# EasyEDA Pro project PX4_FMUv6X_Dev_Board.eprj, schematic FMUv6X Dev Board, sheets 1 to 6 of 11

## Sheets
1 Power MUX: Board Name: Board1; Create Date: 2025-08-13; Page Name: Power MUX; Project Name: PX4_FMUv6X_Dev_Board; Schematic Name: FMUv6X Dev Board; Update Date: 2025-08-14; Company: EasyEDA.com; Page Size: A4; Version: V1.0
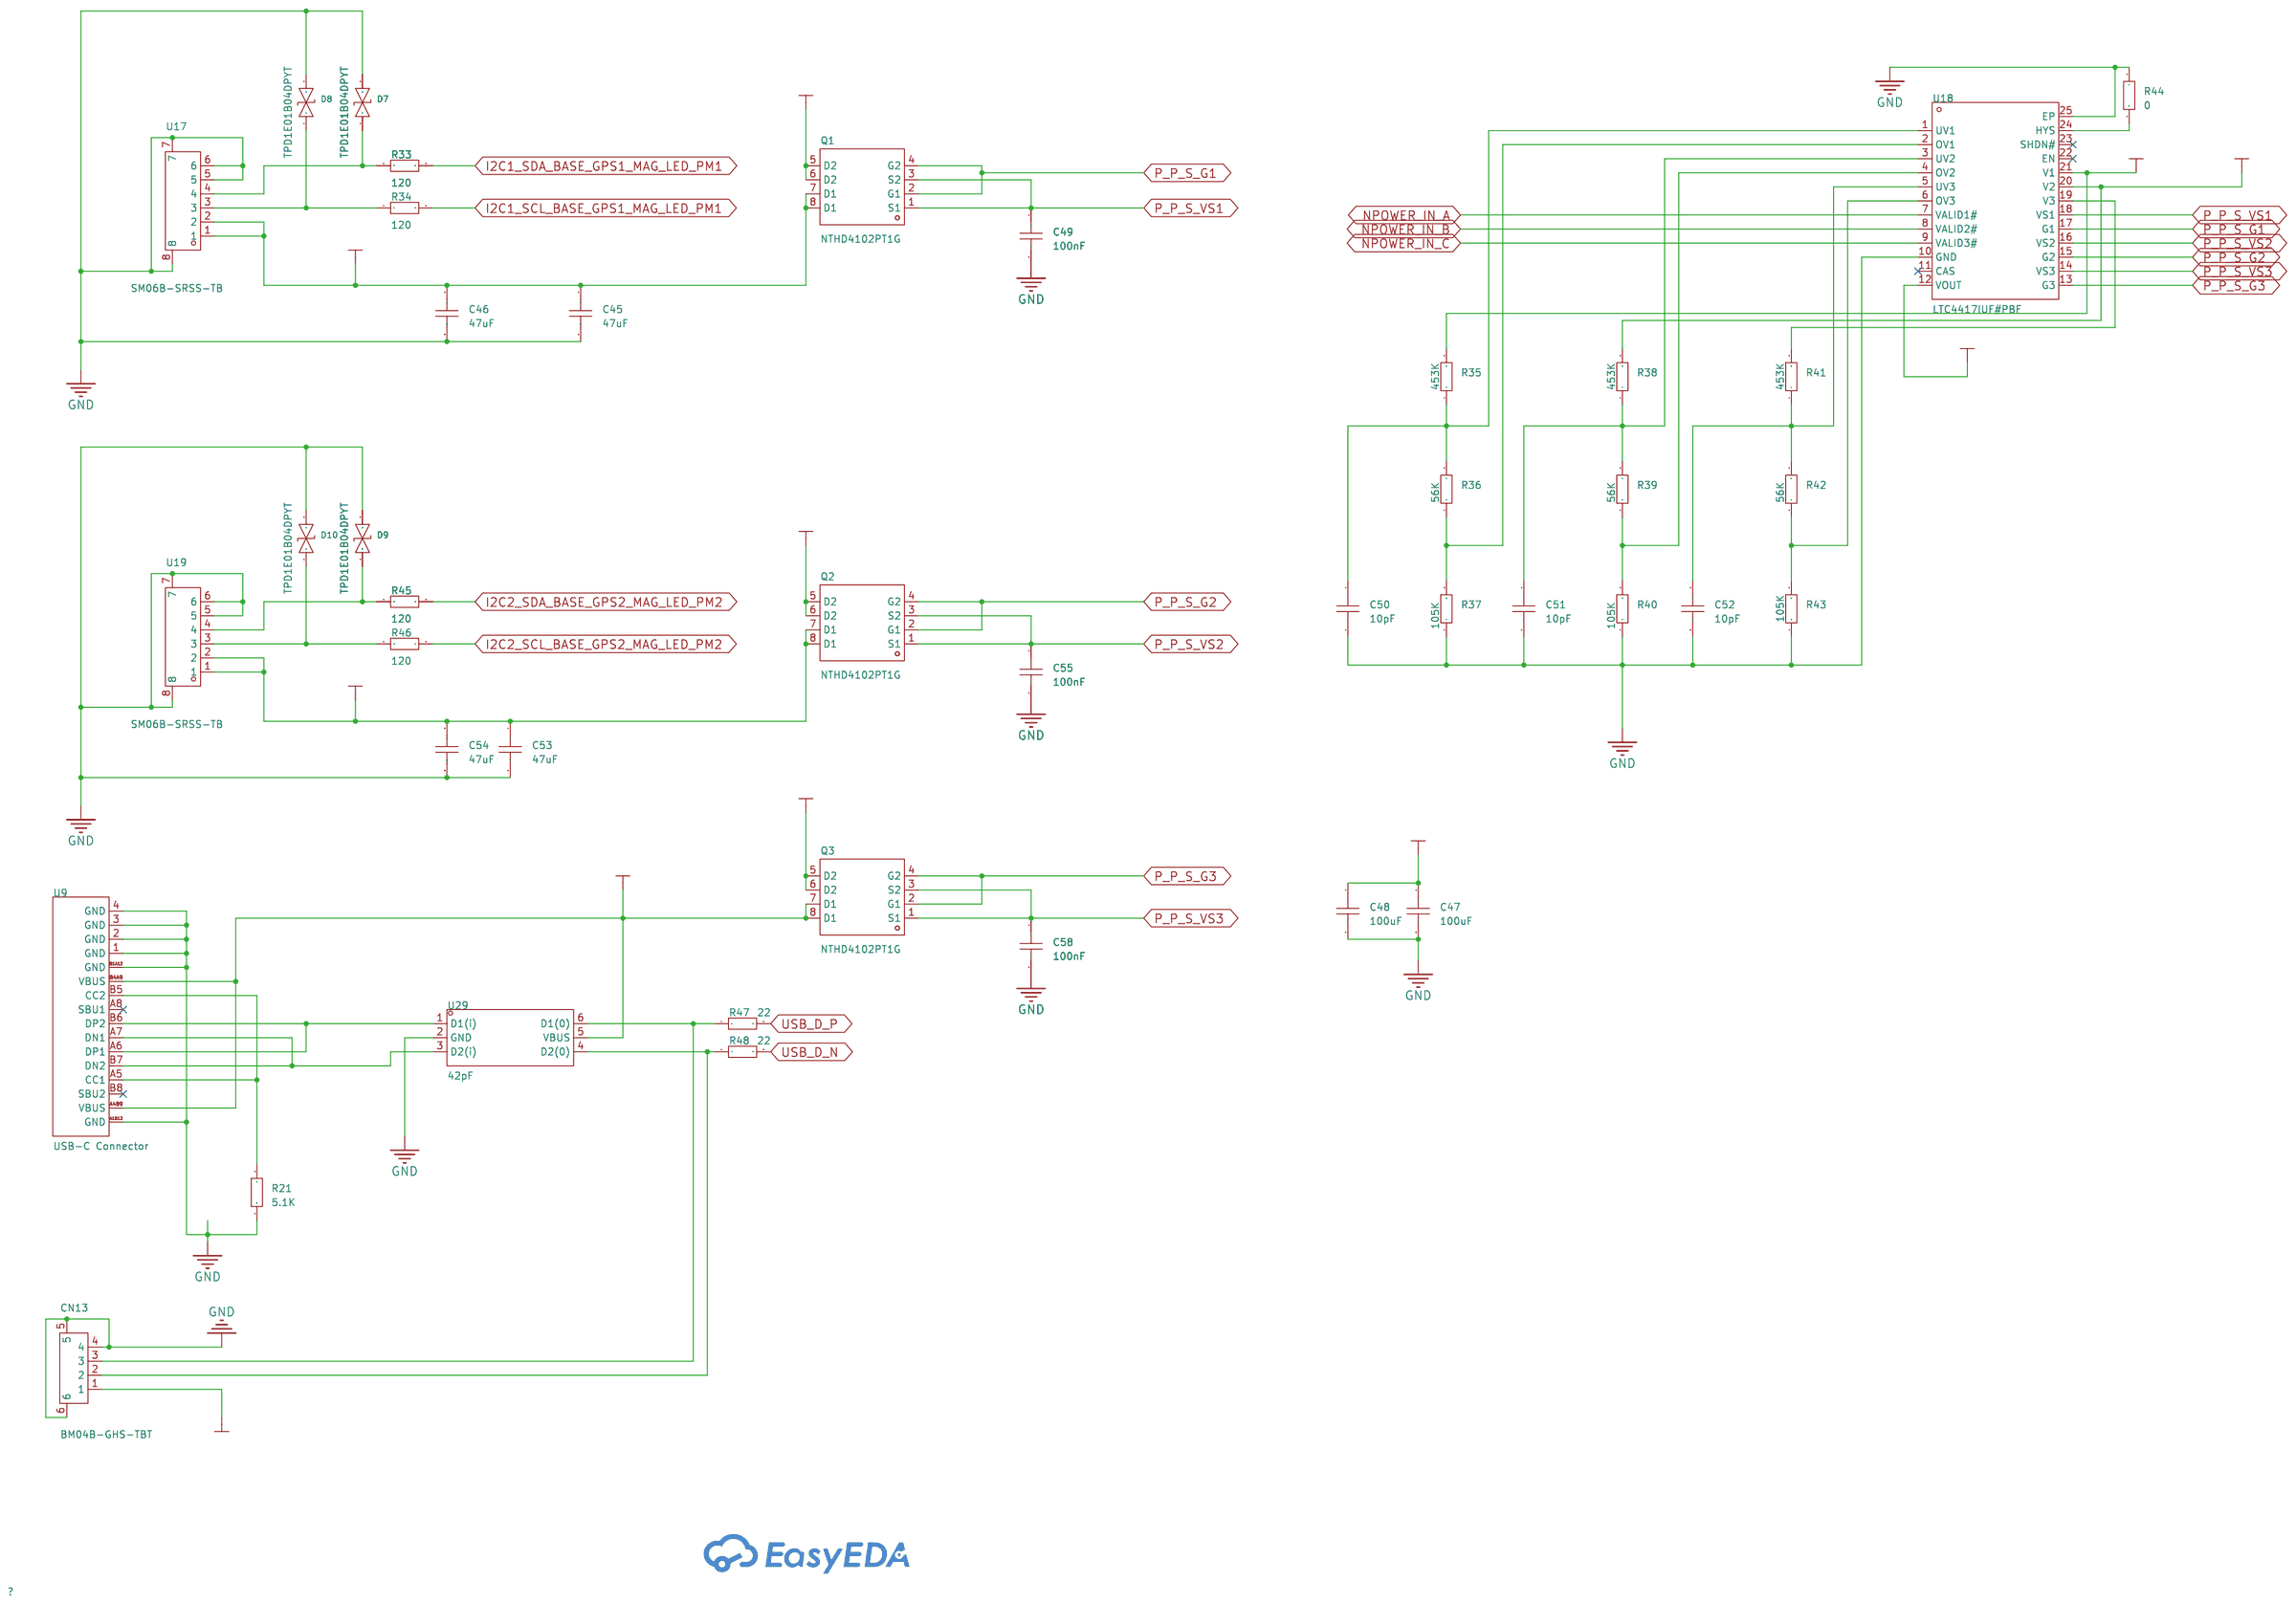
[diagram p0: Power MUX]
2 Power: Page Name: Power; Update Date: 2025-08-17
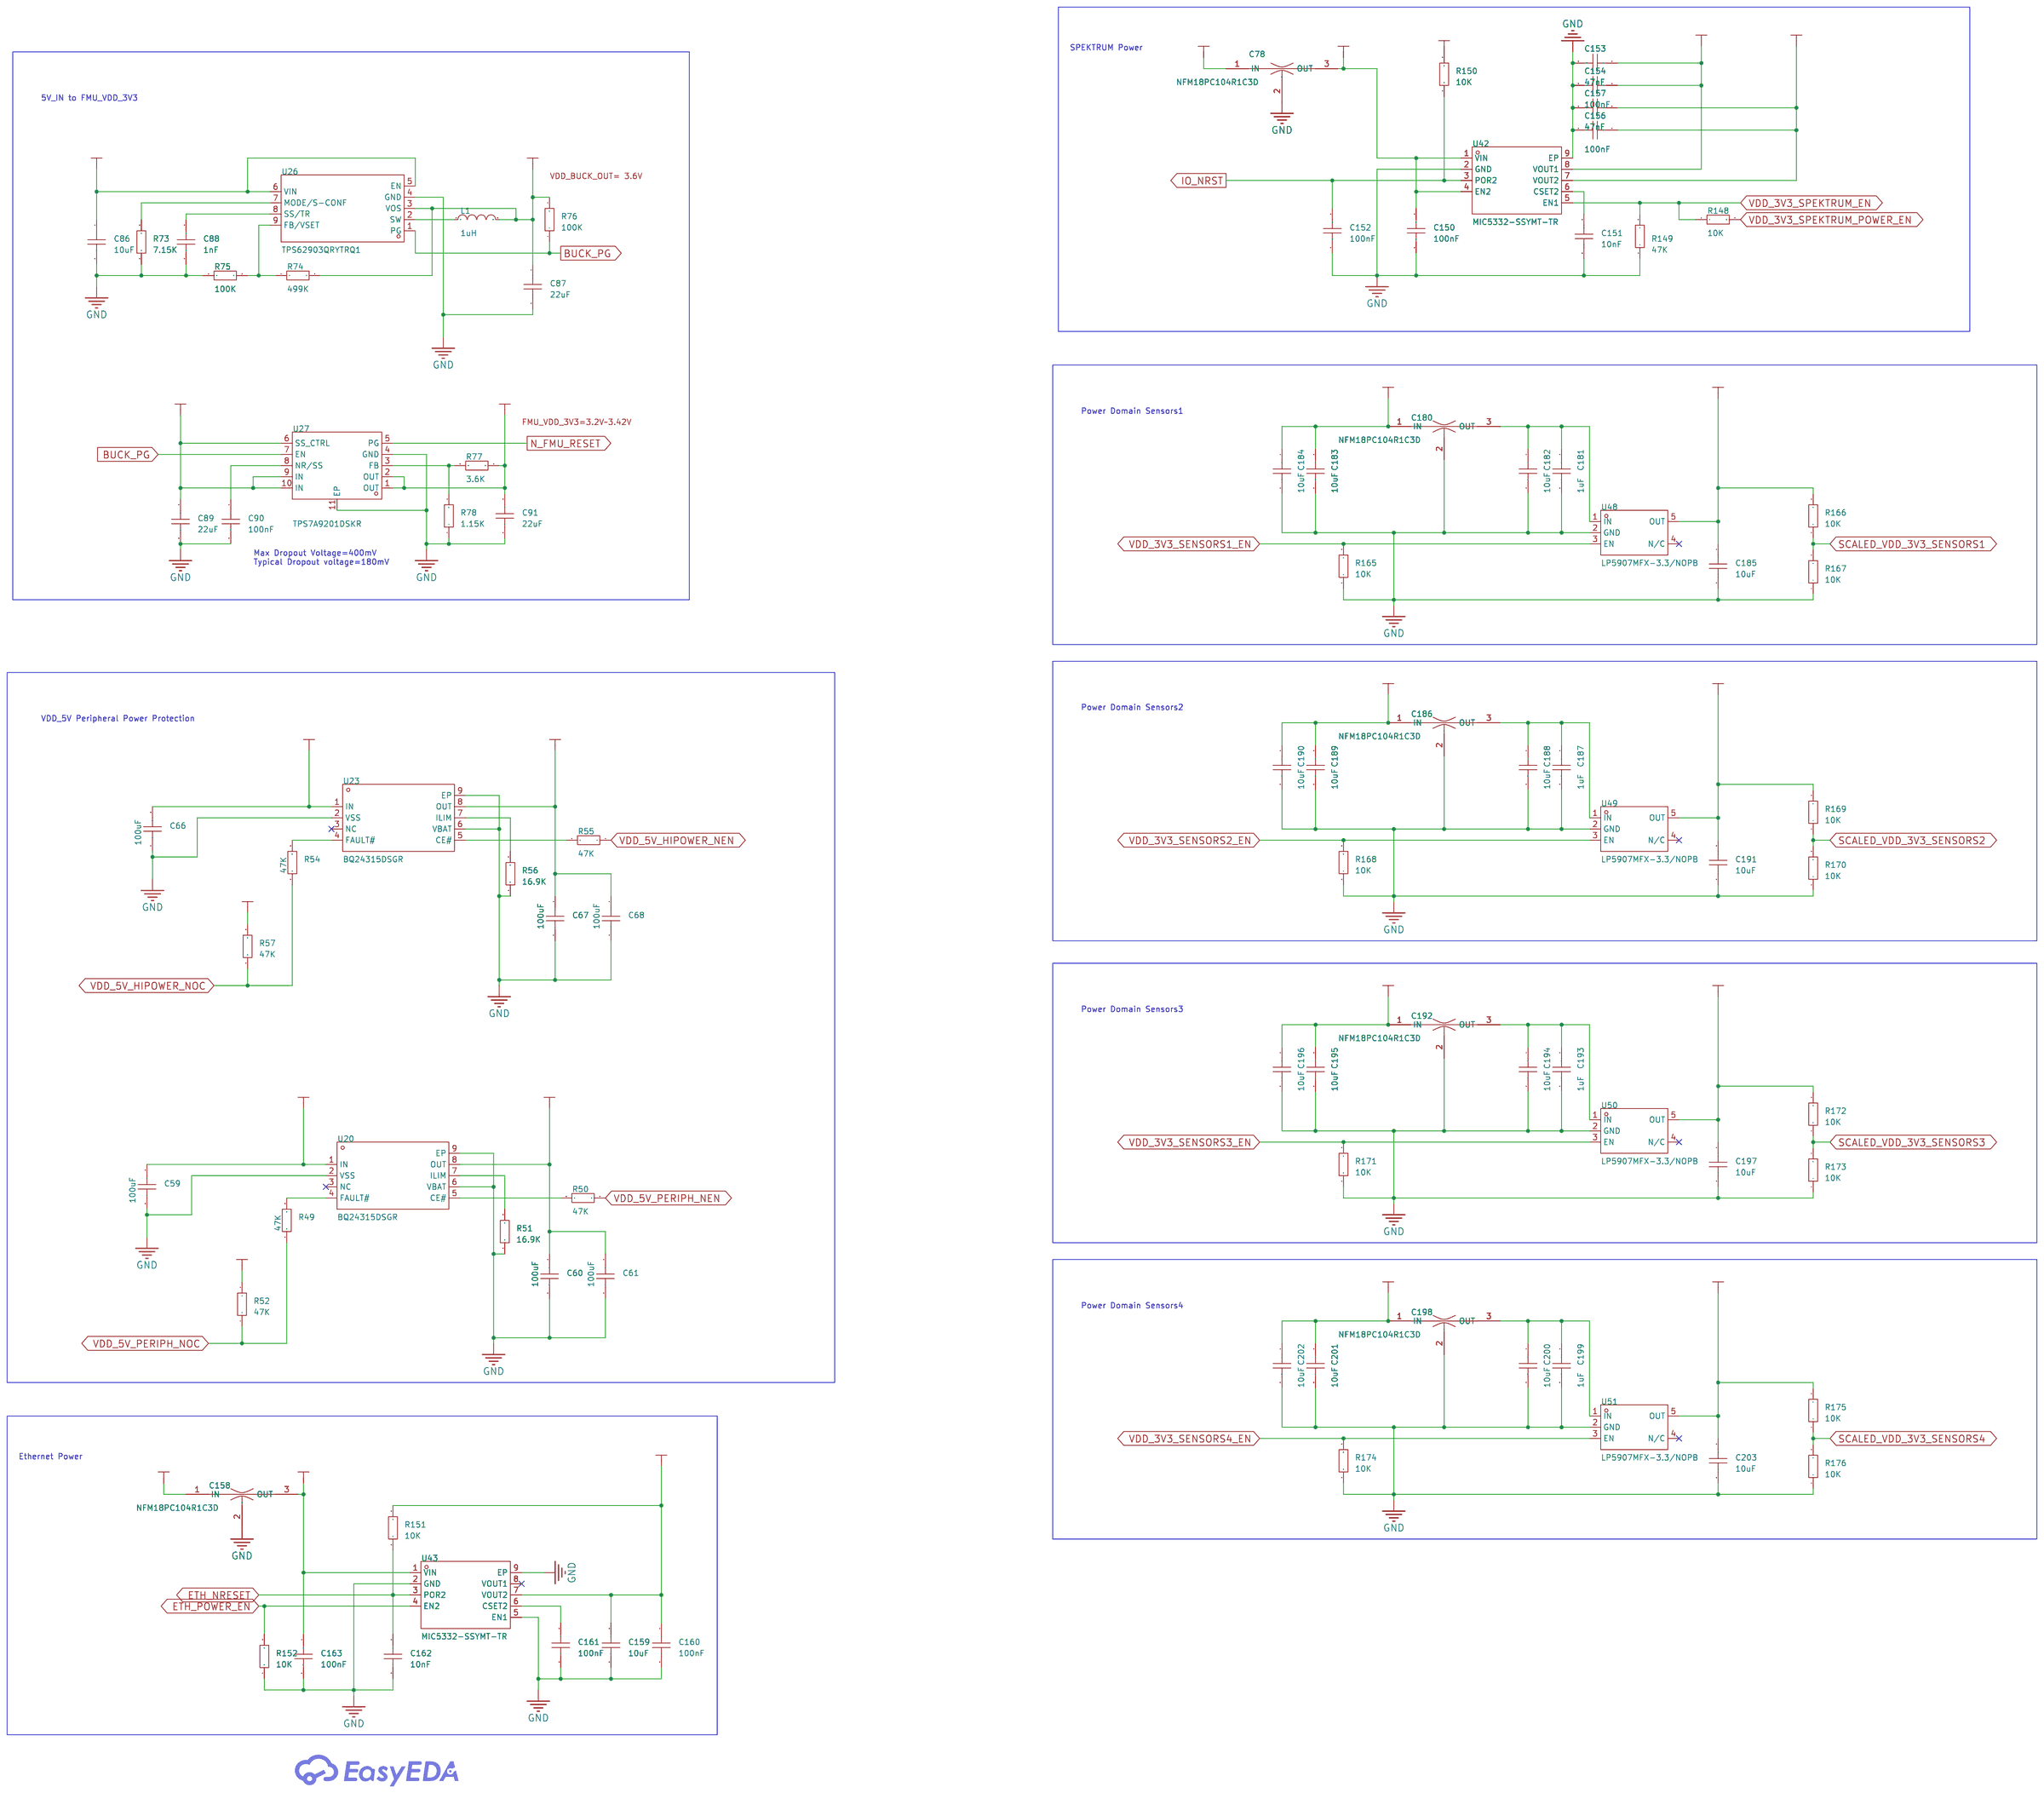
[diagram p1: Power]
3 FMU MCU STM32H753IIK6: Create Date: 2025-08-14; Page Name: FMU MCU STM32H753IIK6; Update Date: 2025-08-17
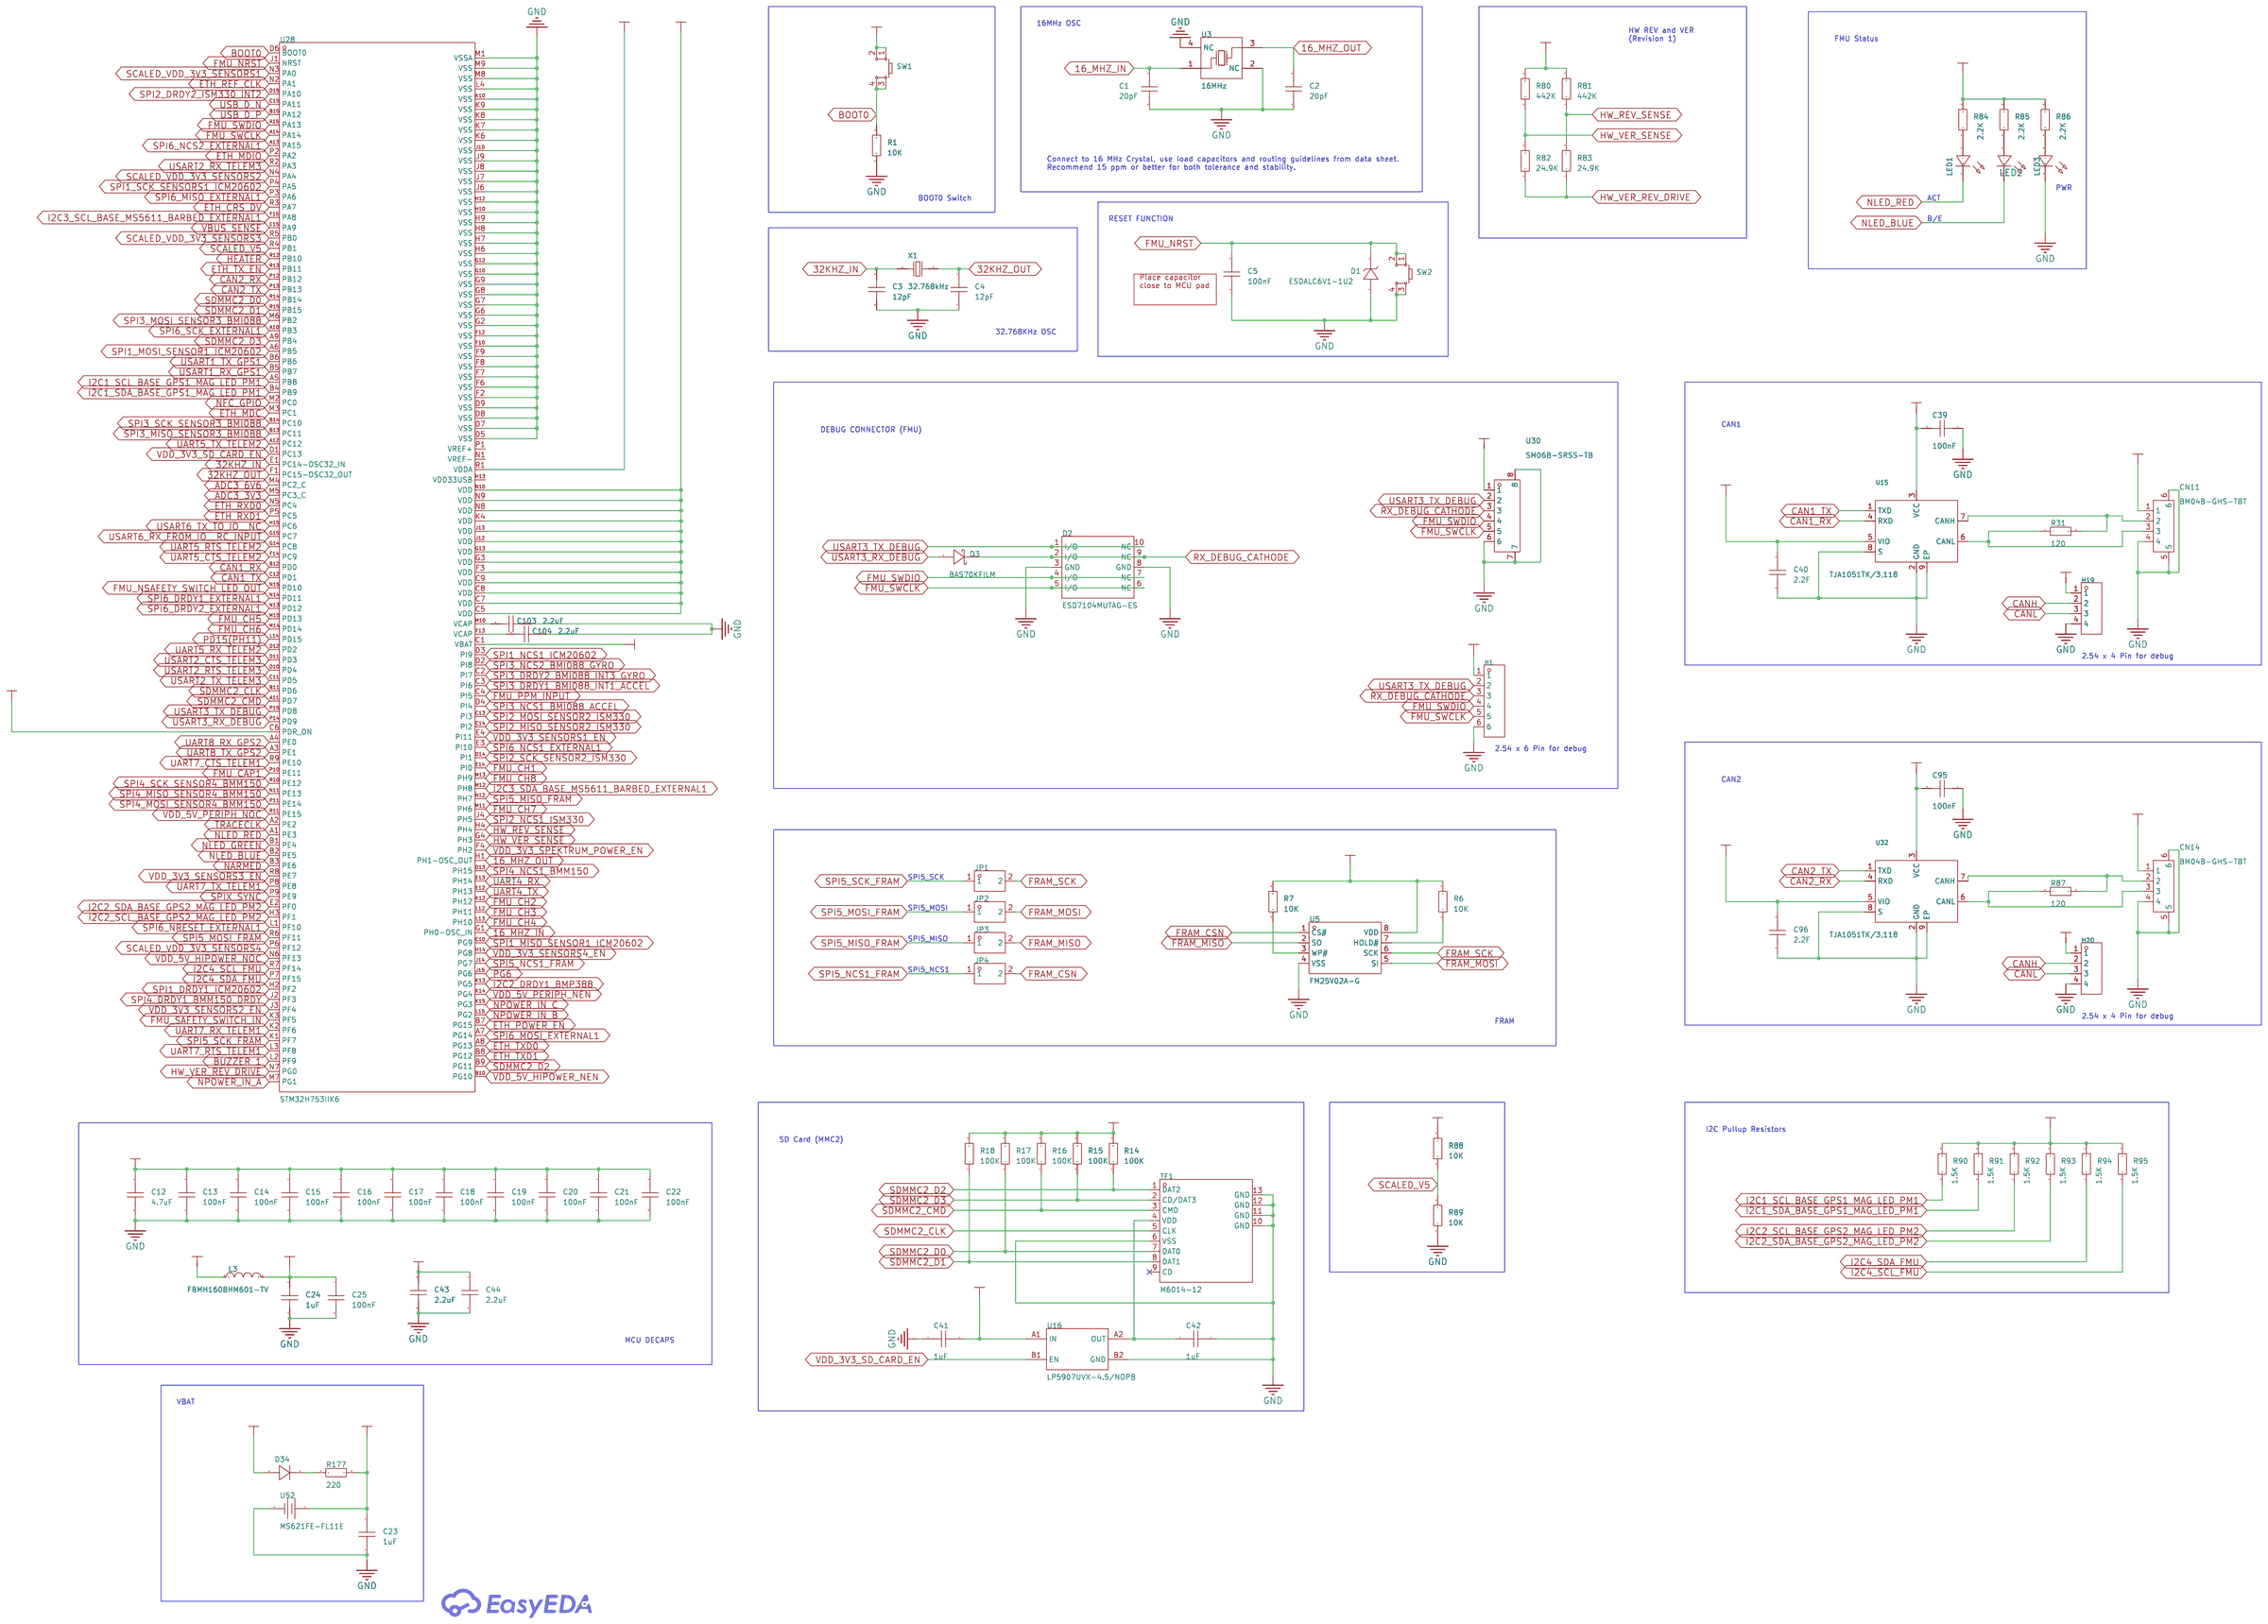
[diagram p2: FMU MCU STM32H753IIK6]
4 Power Description: Create Date: 2025-08-14; Page Name: Power Description
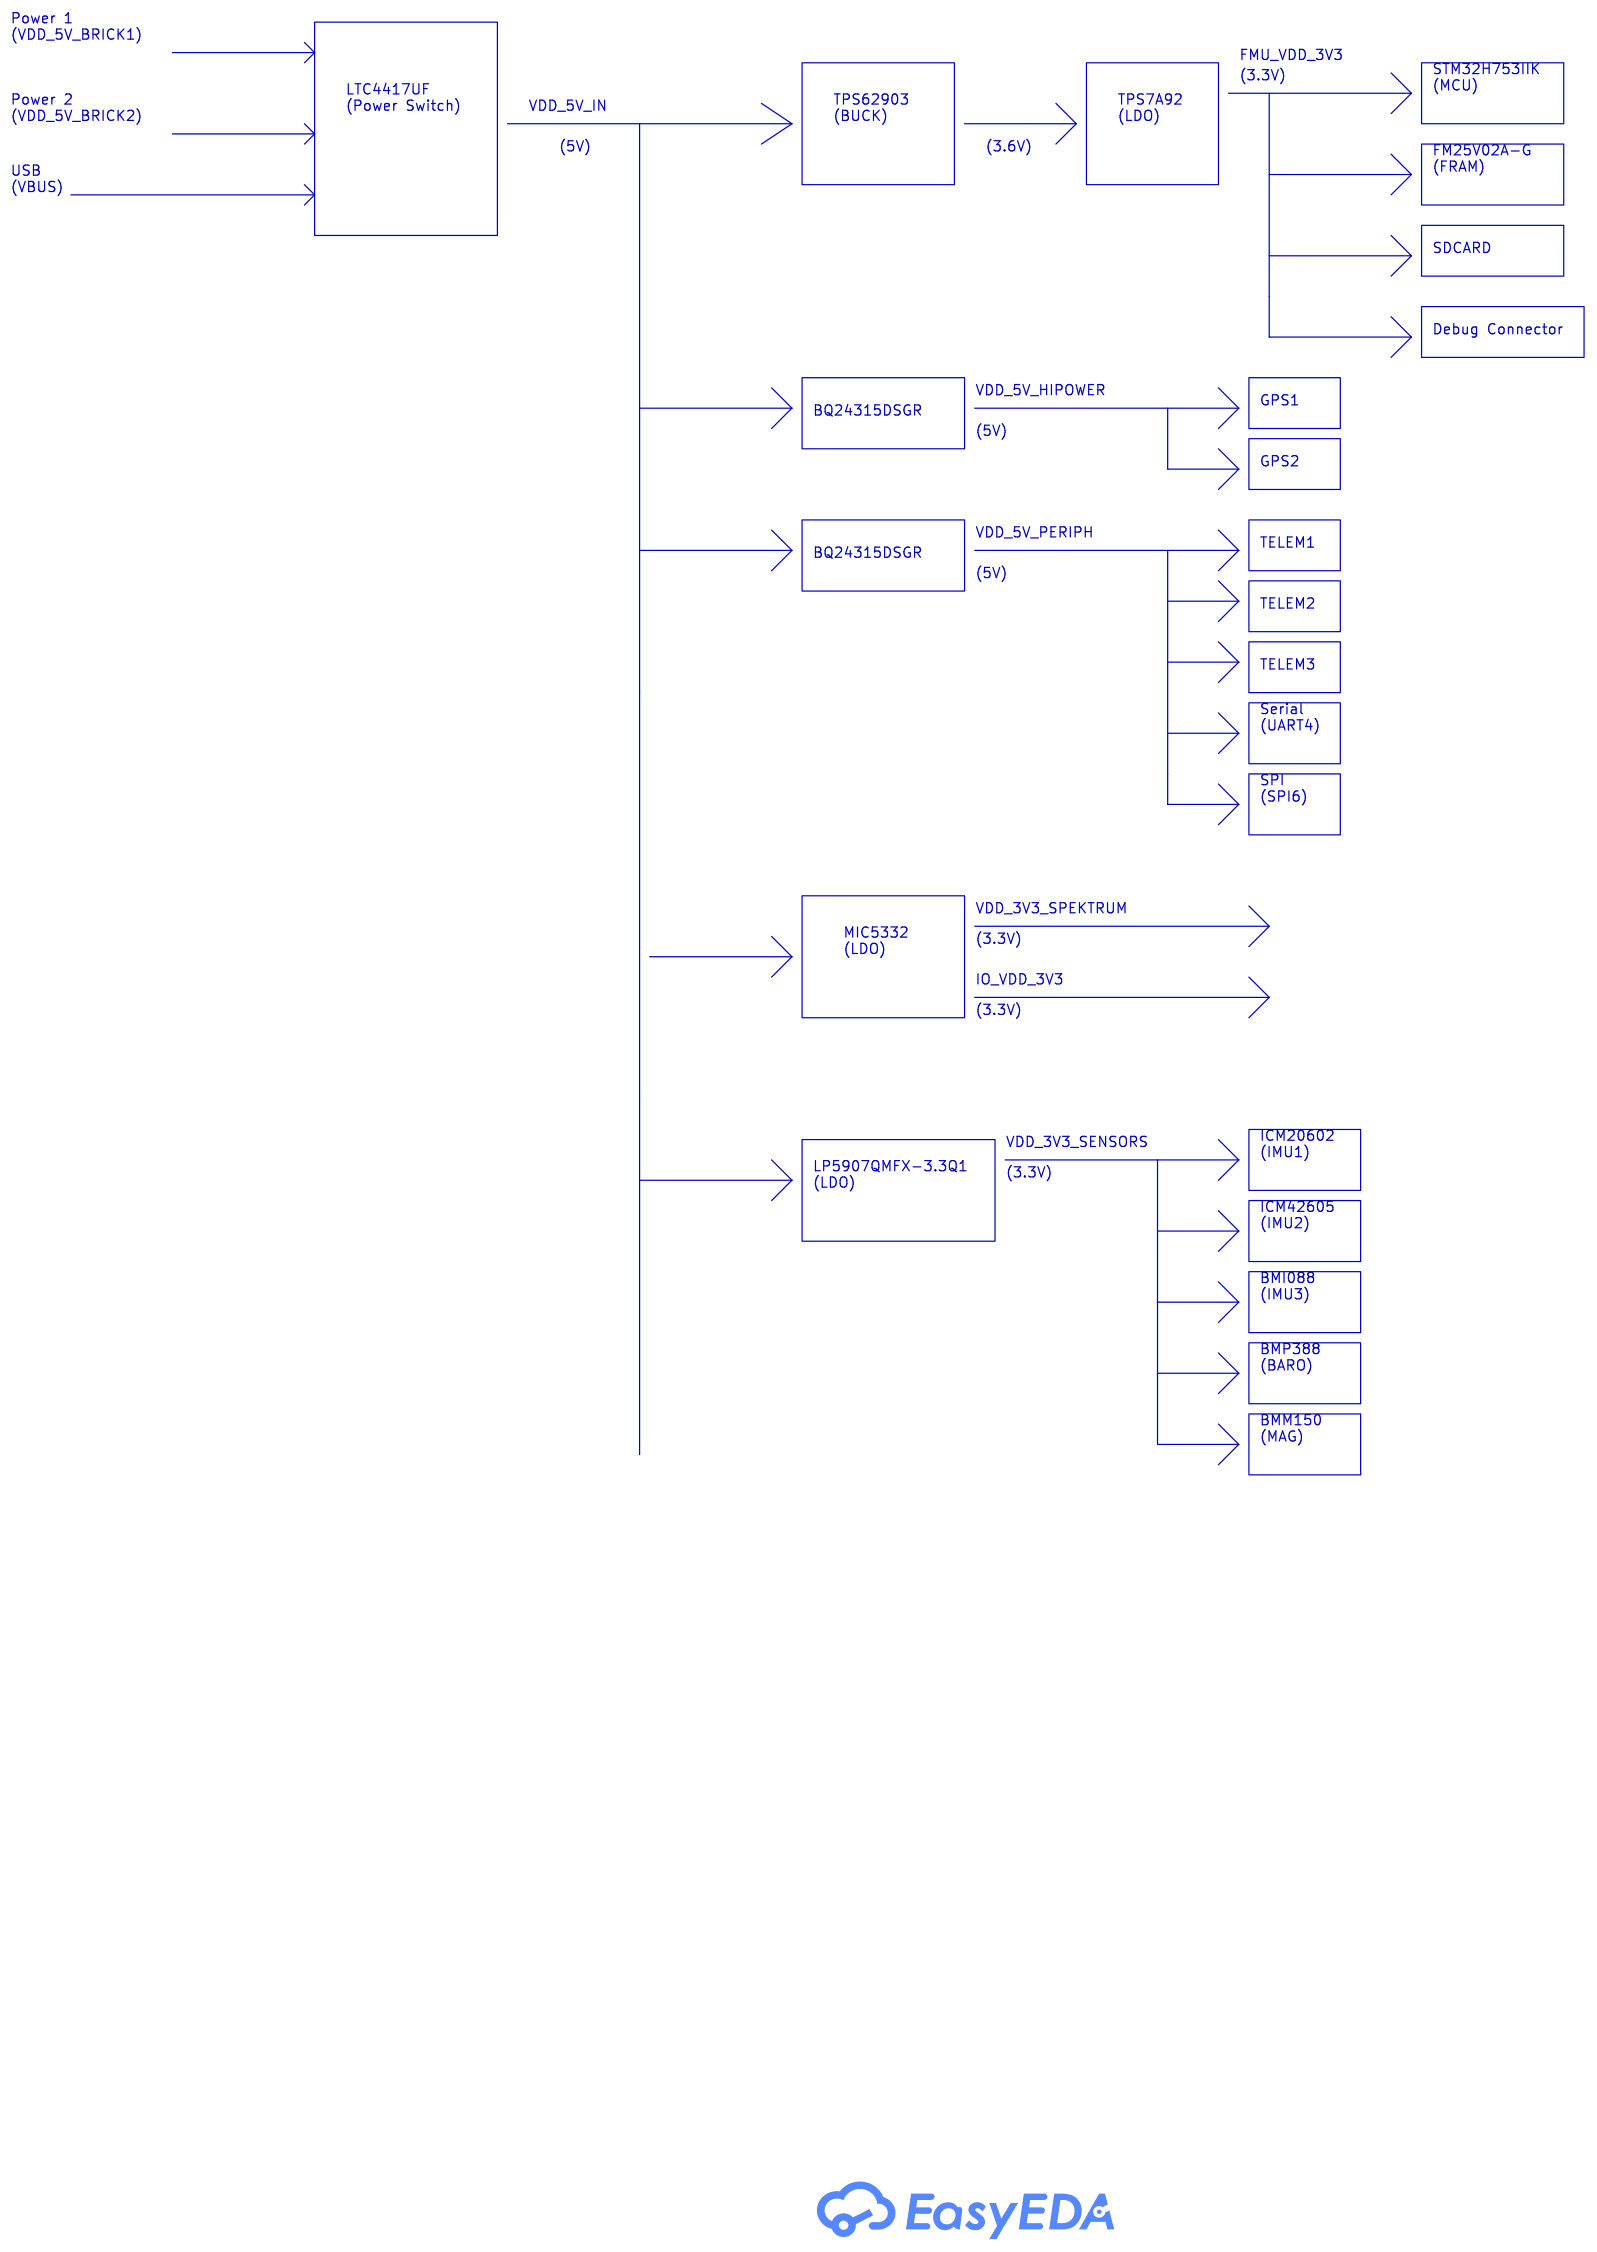
[diagram p3: Power Description]
5 Sensors - FMU Board: Create Date: 2025-08-14; Page Name: Sensors - FMU Board; Update Date: 2025-08-16
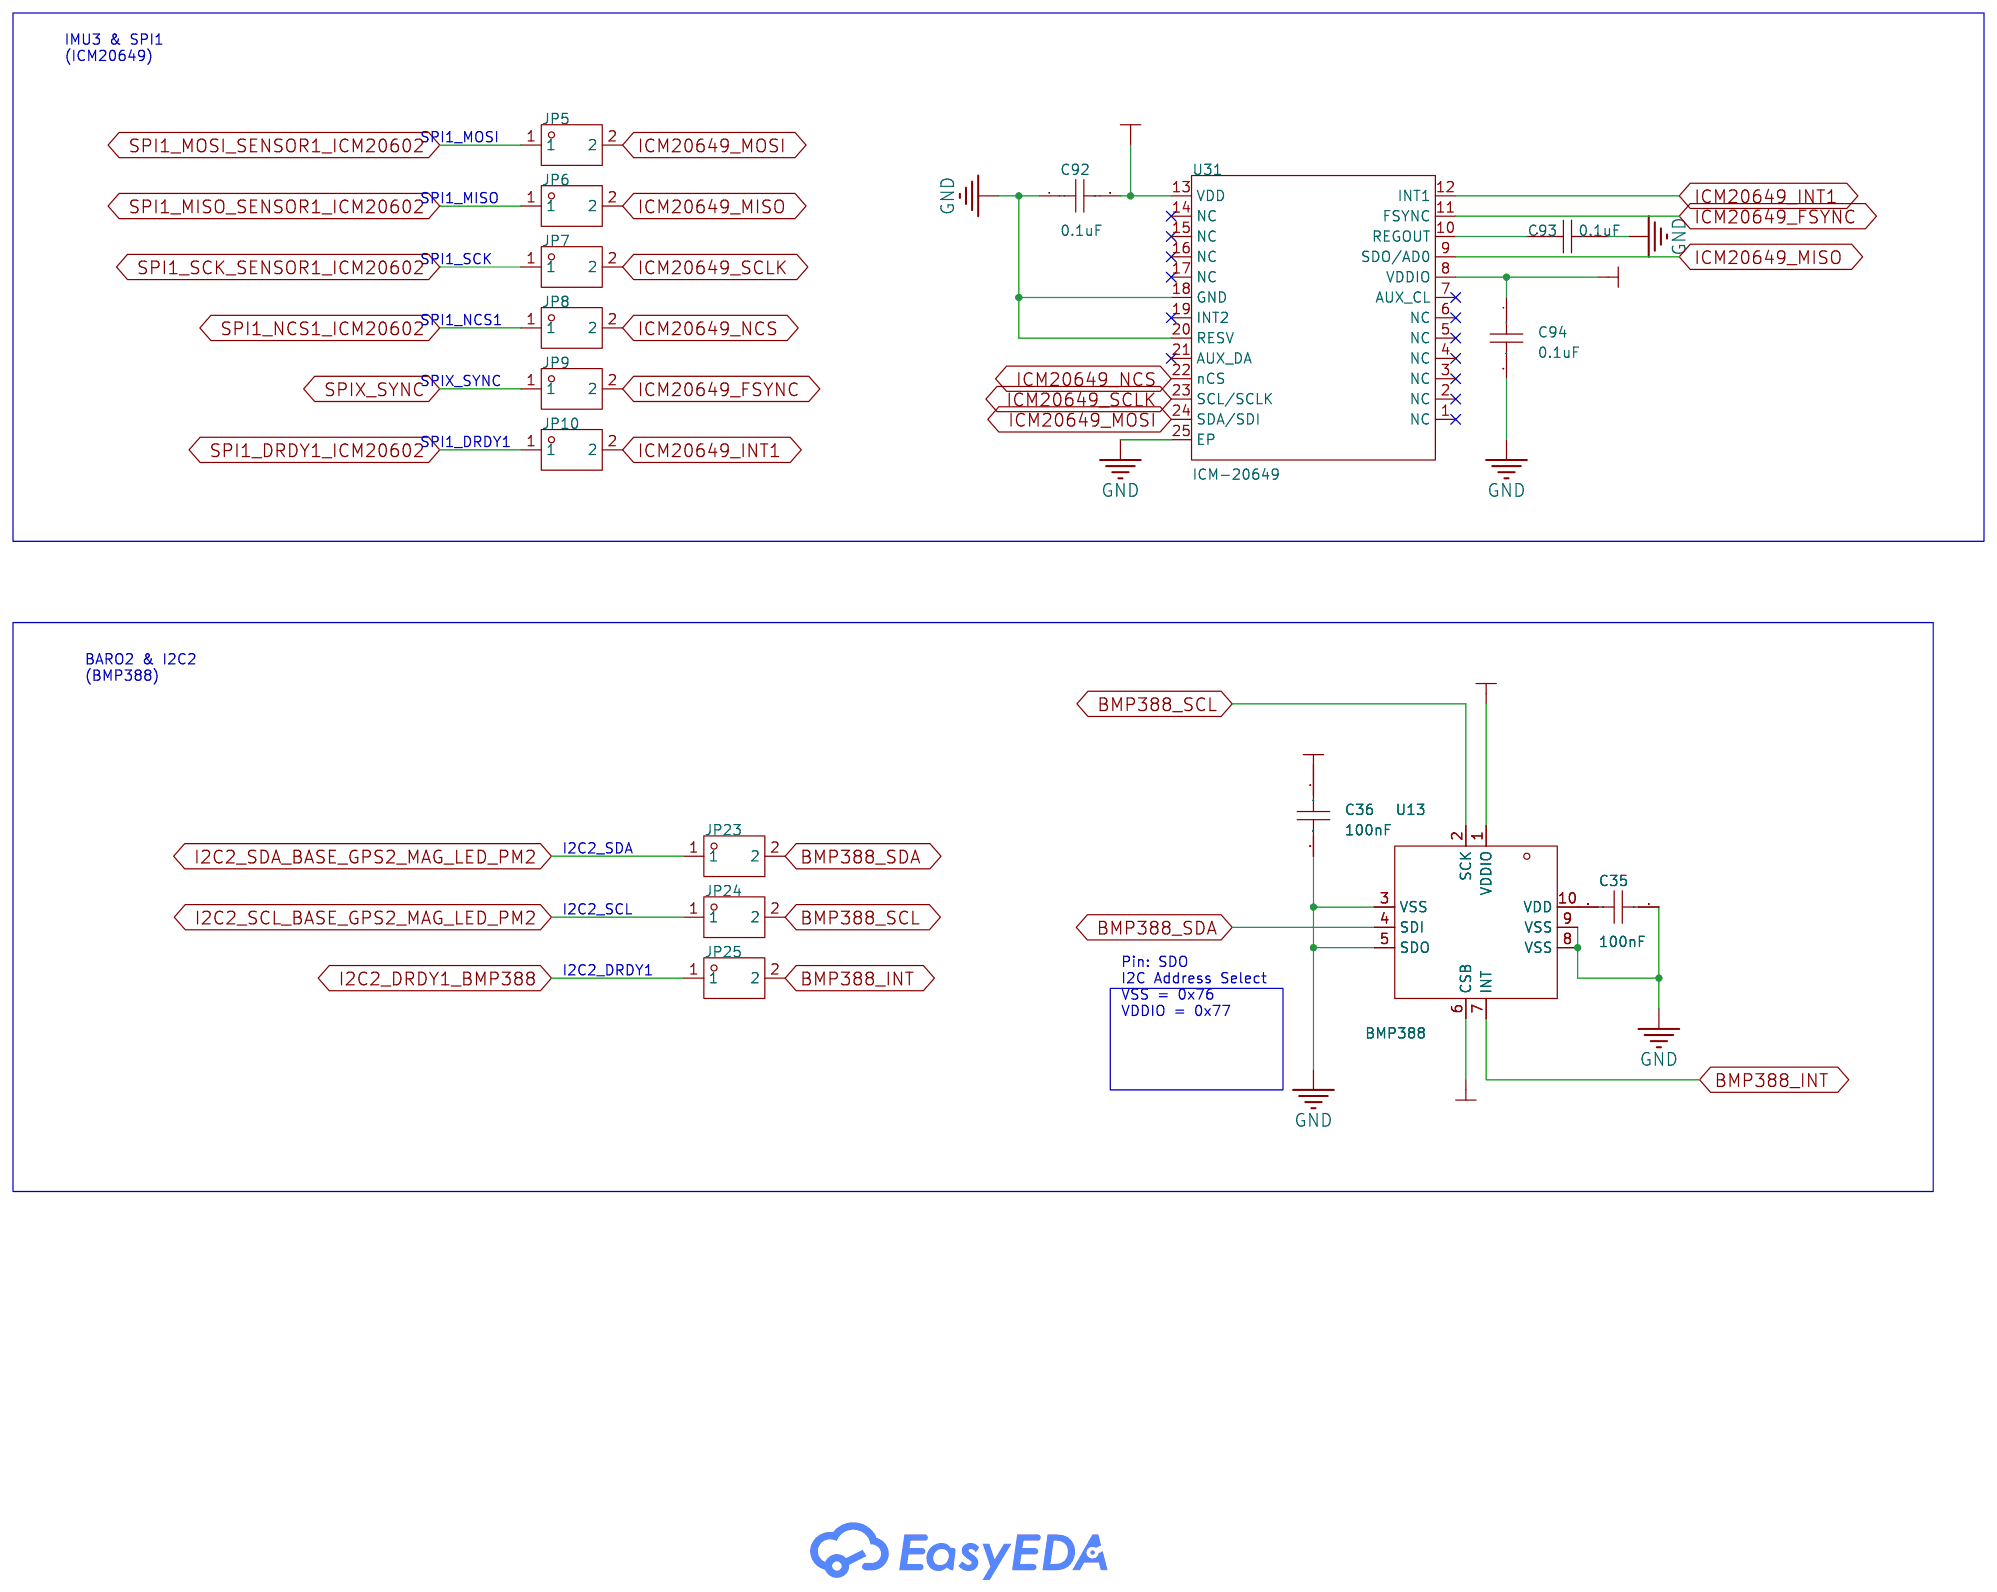
[diagram p4: Sensors - FMU Board]
6 Sensors - IMU Board: Create Date: 2025-08-14; Page Name: Sensors - IMU Board; Update Date: 2025-08-16
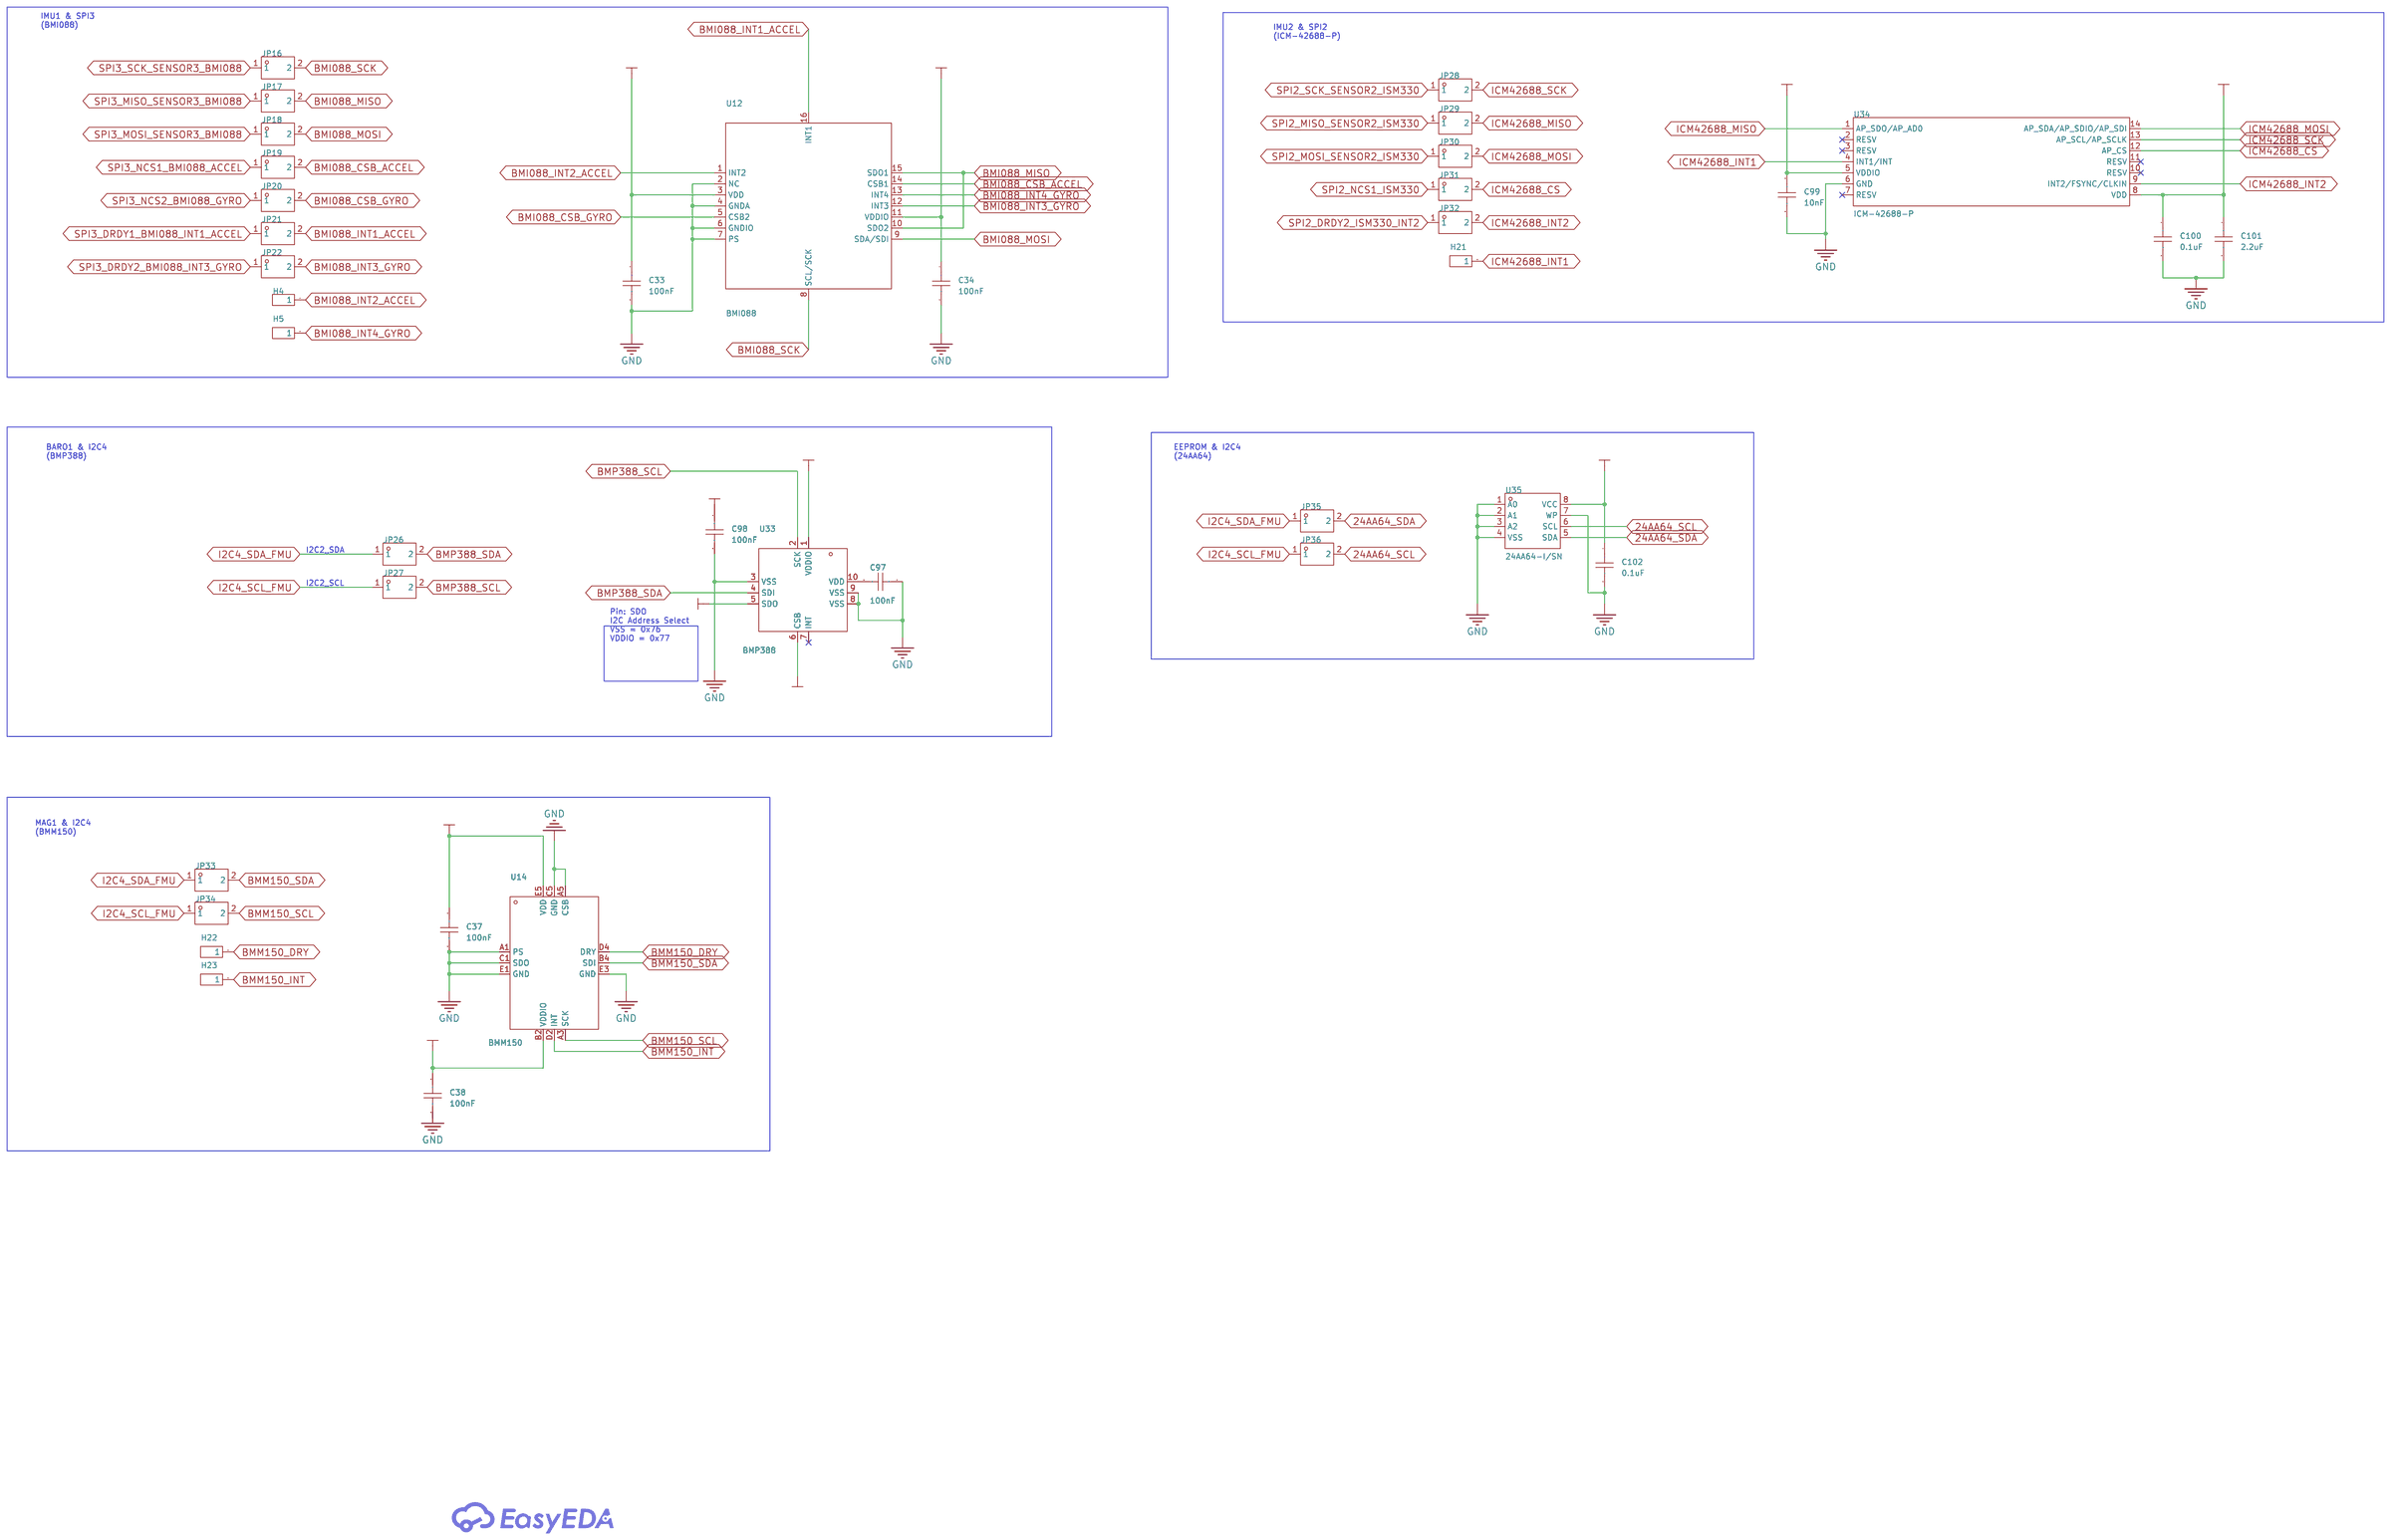
[diagram p5: Sensors - IMU Board]

## Parts
sheet FMU MCU STM32H753IIK6
C1  20pF  [C0201]
C2  20pF  [C0201]
C3  12pF  [C0201]
C4  12pF  [C0201]
C5  100nF  [C0603]
C12  4.7uF  [C0201]
C13  100nF  [C0201]
C14  100nF  [C0201]
C15  100nF  [C0201]
C16  100nF  [C0201]
C17  100nF  [C0201]
C18  100nF  [C0201]
C19  100nF  [C0201]
C20  100nF  [C0201]
C21  100nF  [C0201]
C22  100nF  [C0201]
C23  1uF  [C0201]
C24  1uF  [C0201]
C25  100nF  [C0201]
C39  100nF  [C0201]
C40  2.2F  [C0201]
C41  1uF  [C0201]
C42  1uF  [C0201]
C43  2.2uF  [C0201]
C44  2.2uF  [C0201]
C95  100nF  [C0201]
C96  2.2F  [C0201]
C103  2.2uF  [C0201]
C104  2.2uF  [C0201]
CN11  BM04B-GHS-TBT  [CONN-SMD_4P-P1.25_BM04B-GHS-TBT-LF-SN]
CN14  BM04B-GHS-TBT  [CONN-SMD_4P-P1.25_BM04B-GHS-TBT-LF-SN]
D1  ESDALC6V1-1U2  [DFN0603-D_L0.6-W0.3-P0.34-RD]
D2  ESD7104MUTAG-ES  [DFN-10_L2.5-W1.0-P0.50-BL]
D3  BAS70KFILM  [SOD-523_L1.2-W0.8-LS1.6-RD]
D34  -  [SMA_L4.4-W2.8-LS5.4-RD]
H1  -  [HDR-TH_6P-P2.54-V-F]
H19  -  [HDR-TH_4P-P2.54-V-F]
H20  -  [HDR-TH_4P-P2.54-V-F]
JP1  -  [HDR-TH_2P-P2.54-V-M-2]
JP2  -  [HDR-TH_2P-P2.54-V-M-2]
JP3  -  [HDR-TH_2P-P2.54-V-M-2]
JP4  -  [HDR-TH_2P-P2.54-V-M-2]
L3  FBMH1608HM601-TV  [L0603]
LED1  -  [LED0402-RD_YELLOW]
LED2  -  [LED0402-RD_YELLOW]
LED3  -  [LED0402-RD_YELLOW]
R1  10K  [R0603]
R6  10K  [R0603]
R7  10K  [R0603]
R14  100K  [R0603]
R15  100K  [R0603]
R16  100K  [R0603]
R17  100K  [R0603]
R18  100K  [R0603]
R31  120  [R0603]
R80  442K  [R0603]
R81  442K  [R0603]
R82  24.9K  [R0603]
R83  24.9K  [R0603]
R84  2.2K  [R0603]
R85  2.2K  [R0603]
R86  2.2K  [R0603]
R87  120  [R0603]
R88  10K  [R0603]
R89  10K  [R0603]
R90  1.5K  [R0603]
R91  1.5K  [R0603]
R92  1.5K  [R0603]
R93  1.5K  [R0603]
R94  1.5K  [R0603]
R95  1.5K  [R0603]
R177  220  [R0603]
SW1  -  [SW-SMD_4P-L6.0-W6.0-P4.50-LS9.0-2]
SW2  -  [SW-SMD_4P-L6.0-W6.0-P4.50-LS9.0-2]
TF1  M6014-12  [TF-SMD_M6014-12]
U3  16MHz  [CRYSTAL-SMD_4P-L3.2-W2.5-BL]
U5  FM25V02A-G  [SOIC-8_L4.9-W3.9-P1.27-LS6.0-BL]
U15  TJA1051TK/3,118  [HVSON-8_L3.0-W3.0-P0.65-BL-EP]
U16  LP5907UVX-4.5/NOPB  [DSBGA-4_L0.7-W0.7-R2-C2-P0.35-BL]
U28  STM32H753IIK6  [UFBGA-201_L10.0-W10.0-P0.65-TL_STM32H743IIK6]
U30  SM06B-SRSS-TB  [CONN-SMD_SM06B-SRSS-TBLFSN]
U32  TJA1051TK/3,118  [HVSON-8_L3.0-W3.0-P0.65-BL-EP]
U52  MS621FE-FL11E  [BAT-SMD_FL11E]
X1  32.768kHz  [FC-135R_L3.2-W1.5]
sheet Power MUX
C45  47uF  [C0201]
C46  47uF  [C0201]
C47  100uF  [C0201]
C48  100uF  [C0201]
C49  100nF  [C0201]
C50  10pF  [C0201]
C51  10pF  [C0201]
C52  10pF  [C0201]
C53  47uF  [C0201]
C54  47uF  [C0201]
C55  100nF  [C0201]
C58  100nF  [C0201]
CN13  BM04B-GHS-TBT  [CONN-SMD_4P-P1.25_BM04B-GHS-TBT-LF-SN]
D7  TPD1E01B04DPYT  [X1SON-2_L1.0-W0.6-P0.65-BI]
D8  TPD1E01B04DPYT  [X1SON-2_L1.0-W0.6-P0.65-BI]
D9  TPD1E01B04DPYT  [X1SON-2_L1.0-W0.6-P0.65-BI]
D10  TPD1E01B04DPYT  [X1SON-2_L1.0-W0.6-P0.65-BI]
Q1  NTHD4102PT1G  [MOS-SMD-8_L3.1-W1.7-P0.65-BL]
Q2  NTHD4102PT1G  [MOS-SMD-8_L3.1-W1.7-P0.65-BL]
Q3  NTHD4102PT1G  [MOS-SMD-8_L3.1-W1.7-P0.65-BL]
R21  5.1K  [R0603]
R33  120  [R0603]
R34  120  [R0603]
R35  453K  [R0603]
R36  56K  [R0603]
R37  105K  [R0603]
R38  453K  [R0603]
R39  56K  [R0603]
R40  105K  [R0603]
R41  453K  [R0603]
R42  56K  [R0603]
R43  105K  [R0603]
R44  0  [R0603]
R45  120  [R0603]
R46  120  [R0603]
R47  22  [R0603]
R48  22  [R0603]
U9  USB-C Connector  [USB-C-SMD_GT-USB-7010E-1]
U17  SM06B-SRSS-TB  [CONN-SMD_SM06B-SRSS-TBLFSN]
U18  LTC4417IUF#PBF  [QFN-24_L4.0-W4.0-P0.50-TL-EP2.5]
U19  SM06B-SRSS-TB  [CONN-SMD_SM06B-SRSS-TBLFSN]
U29  42pF  [SOT-563_L1.6-W1.2-P0.50-LS1.6-TL]
sheet Power
C59  100uF  [C0201]
C60  100uF  [C0201]
C61  100uF  [C0201]
C66  100uF  [C0201]
C67  100uF  [C0201]
C68  100uF  [C0201]
C78  NFM18PC104R1C3D  [FILTER-SMD_3P-L1.6-W0.8-L_NFM18CC223R1C3D]
C86  10uF  [C0201]
C87  22uF  [C0201]
C88  1nF  [C0201]
C89  22uF  [C0201]
C90  100nF  [C0201]
C91  22uF  [C0201]
C150  100nF  [C0201]
C151  10nF  [C0201]
C152  100nF  [C0201]
C153  47nF  [C0201]
C154  100nF  [C0201]
C156  100nF  [C0201]
C157  47nF  [C0201]
C158  NFM18PC104R1C3D  [FILTER-SMD_3P-L1.6-W0.8-L_NFM18CC223R1C3D]
C159  10uF  [C0201]
C160  100nF  [C0201]
C161  100nF  [C0201]
C162  10nF  [C0201]
C163  100nF  [C0201]
C180  NFM18PC104R1C3D  [FILTER-SMD_3P-L1.6-W0.8-L_NFM18CC223R1C3D]
C181  1uF  [C0201]
C182  10uF  [C0201]
C183  10uF  [C0201]
C184  10uF  [C0201]
C185  10uF  [C0201]
C186  NFM18PC104R1C3D  [FILTER-SMD_3P-L1.6-W0.8-L_NFM18CC223R1C3D]
C187  1uF  [C0201]
C188  10uF  [C0201]
C189  10uF  [C0201]
C190  10uF  [C0201]
C191  10uF  [C0201]
C192  NFM18PC104R1C3D  [FILTER-SMD_3P-L1.6-W0.8-L_NFM18CC223R1C3D]
C193  1uF  [C0201]
C194  10uF  [C0201]
C195  10uF  [C0201]
C196  10uF  [C0201]
C197  10uF  [C0201]
C198  NFM18PC104R1C3D  [FILTER-SMD_3P-L1.6-W0.8-L_NFM18CC223R1C3D]
C199  1uF  [C0201]
C200  10uF  [C0201]
C201  10uF  [C0201]
C202  10uF  [C0201]
C203  10uF  [C0201]
L1  1uH  [L0402]
R49  47K  [R0603]
R50  47K  [R0603]
R51  16.9K  [R0603]
R52  47K  [R0603]
R54  47K  [R0603]
R55  47K  [R0603]
R56  16.9K  [R0603]
R57  47K  [R0603]
R73  7.15K  [R0603]
R74  499K  [R0603]
R75  100K  [R0603]
R76  100K  [R0603]
R77  3.6K  [R0603]
R78  1.15K  [R0603]
R148  10K  [R0603]
R149  47K  [R0603]
R150  10K  [R0603]
R151  10K  [R0603]
R152  10K  [R0603]
R165  10K  [R0603]
R166  10K  [R0603]
R167  10K  [R0603]
R168  10K  [R0603]
R169  10K  [R0603]
R170  10K  [R0603]
R171  10K  [R0603]
R172  10K  [R0603]
R173  10K  [R0603]
R174  10K  [R0603]
R175  10K  [R0603]
R176  10K  [R0603]
U20  BQ24315DSGR  [WSON-8_L2.0-W2.0-P0.65-BL-EP]
U23  BQ24315DSGR  [WSON-8_L2.0-W2.0-P0.65-BL-EP]
U26  TPS62903QRYTRQ1  [VQFNHR-9_L2.2-W2.0_TPS62993QRYTRQ1]
U27  TPS7A9201DSKR  [TDFN-10_L2.5-W2.5-P0.50-BL-EP]
U42  MIC5332-SSYMT-TR  [MLF-8_L2.0-W2.0-P0.50-BL-EP]
U43  MIC5332-SSYMT-TR  [MLF-8_L2.0-W2.0-P0.50-BL-EP]
U48  LP5907MFX-3.3/NOPB  [SOT-23-5_L3.0-W1.7-P0.95-LS2.8-BR]
U49  LP5907MFX-3.3/NOPB  [SOT-23-5_L3.0-W1.7-P0.95-LS2.8-BR]
U50  LP5907MFX-3.3/NOPB  [SOT-23-5_L3.0-W1.7-P0.95-LS2.8-BR]
U51  LP5907MFX-3.3/NOPB  [SOT-23-5_L3.0-W1.7-P0.95-LS2.8-BR]
sheet Sensors - FMU Board
C35  100nF  [C0201]
C36  100nF  [C0201]
C92  0.1uF  [C0201]
C93  0.1uF  [C0201]
C94  0.1uF  [C0201]
JP5  -  [HDR-TH_2P-P2.54-V-M-2]
JP6  -  [HDR-TH_2P-P2.54-V-M-2]
JP7  -  [HDR-TH_2P-P2.54-V-M-2]
JP8  -  [HDR-TH_2P-P2.54-V-M-2]
JP9  -  [HDR-TH_2P-P2.54-V-M-2]
JP10  -  [HDR-TH_2P-P2.54-V-M-2]
JP23  -  [HDR-TH_2P-P2.54-V-M-2]
JP24  -  [HDR-TH_2P-P2.54-V-M-2]
JP25  -  [HDR-TH_2P-P2.54-V-M-2]
U13  BMP388  [SENSORM-SMD_BMP388]
U31  ICM-20649  [QFN-24_L3.0-W3.0-P0.40-TL-EP1.4]
sheet Sensors - IMU Board
C33  100nF  [C0201]
C34  100nF  [C0201]
C37  100nF  [C0201]
C38  100nF  [C0201]
C97  100nF  [C0201]
C98  100nF  [C0201]
C99  10nF  [C0201]
C100  0.1uF  [C0201]
C101  2.2uF  [C0201]
C102  0.1uF  [C0201]
H4  -  [HDR-TH_1P-V-M_XKB_X4611WV-01I-C28D40]
H5  -  [HDR-TH_1P-V-M_XKB_X4611WV-01I-C28D40]
H21  -  [HDR-TH_1P-V-M_XKB_X4611WV-01I-C28D40]
H22  -  [HDR-TH_1P-V-M_XKB_X4611WV-01I-C28D40]
H23  -  [HDR-TH_1P-V-M_XKB_X4611WV-01I-C28D40]
JP16  -  [HDR-TH_2P-P2.54-V-M-2]
JP17  -  [HDR-TH_2P-P2.54-V-M-2]
JP18  -  [HDR-TH_2P-P2.54-V-M-2]
JP19  -  [HDR-TH_2P-P2.54-V-M-2]
JP20  -  [HDR-TH_2P-P2.54-V-M-2]
JP21  -  [HDR-TH_2P-P2.54-V-M-2]
JP22  -  [HDR-TH_2P-P2.54-V-M-2]
JP26  -  [HDR-TH_2P-P2.54-V-M-2]
JP27  -  [HDR-TH_2P-P2.54-V-M-2]
JP28  -  [HDR-TH_2P-P2.54-V-M-2]
JP29  -  [HDR-TH_2P-P2.54-V-M-2]
JP30  -  [HDR-TH_2P-P2.54-V-M-2]
JP31  -  [HDR-TH_2P-P2.54-V-M-2]
JP32  -  [HDR-TH_2P-P2.54-V-M-2]
JP33  -  [HDR-TH_2P-P2.54-V-M-2]
JP34  -  [HDR-TH_2P-P2.54-V-M-2]
JP35  -  [HDR-TH_2P-P2.54-V-M-2]
JP36  -  [HDR-TH_2P-P2.54-V-M-2]
U12  BMI088  [LGA-16_L4.5-W3.0-P0.50-BL]
U14  BMM150  [WLCSP-12_L1.6-W1.6_BMM150]
U33  BMP388  [SENSORM-SMD_BMP388]
U34  ICM-42688-P  [LGA-14_L3.0-W2.5-P0.50-TL]
U35  24AA64-I/SN  [SOIC-8_L5.0-W4.0-P1.27-LS6.0-BL]

## Library data of the parts
C1-C4 C12-C25 C33-C55 C58-C61 C66-C68 C86-C104 C150-C154 C156 C157 C159-C163 C181-C185 C187-C191 C193-C197 C199-C203 = CAP_0201: Supplier Footprint: 0201
C5 = CAP_0603: Supplier Footprint: 0603
CN11 CN13 CN14 = BM04B-GHS-TBT: Pins Structure:1x4P Pitch:1.25mm Mounting Type:Vertical welding Reference Series:GH Number of Pins:4P Number of Rows:1 Number of PINs Per Row:4 Row Spacing:- Current Rating:1A Contact Material:Phosphor Bronze Contact Plating:Tin Operating Temperature:-25℃; LCSC Part Name: 1x4P 间距:1.25mm 立贴 系列:GH; Supplier Part: C20089142; Manufacturer: JST; Supplier Footprint: SMD,P=1.25mm; JLCPCB Part Class: Extended Part; Datasheet: https://atta.szlcsc.com/upload/public/pdf/source/20221128/D5F81EE9B4EA03745FB033843433A0AF.pdf; Supplier: LCSC; Pins Structure: 1x4P; Pitch: 1.25mm; Mounting Type: Vertical welding; Reference Series: GH; Number of Pins: 4P; Number of Rows: 1; Number of PINs Per Row: 4; Current Rating: 1A; Contact Material: Phosphor Bronze; Contact Plating: Tin; Operating Temperature: -25℃~+85℃; Voltage Rating: 50V; Plastic Material: PA9T; Flame Retardant Rating: UL94V-0; Supplementary Features: Auxiliary soldering legs; Color: White; Z-Height of the Board: 4.05mm; X-Length of Bottom Edge on Board (Spacing Line): 8.25mm; Y-Width of Bottom Edge on Board: 4.32mm
D1 = ESDALC6V1-1U2: Reverse Stand-Off Voltage (Vrwm):3V Maximum Clamping Voltage:6.1V Peak Pulse Power Dissipation (Ppp):20W Breakdown Voltage:6.1V Number of Lines:Single channel Operating Temperature:-40℃~+125℃@(Tj) Operating Temperature:-40℃~+125℃@(Tj) Type:ESD; Supplier Part: C1974498; Manufacturer: ST(意法半导体); Supplier Footprint: 0201; JLCPCB Part Class: Extended Part; Datasheet: https://atta.szlcsc.com/upload/public/pdf/source/20210702/A9E16A8F1942D08FD4D8010EFF157F4D.pdf; Supplier: LCSC; Reverse Stand-Off Voltage (Vrwm): 3V; Maximum Clamping Voltage: 6.1V; Peak Pulse Power Dissipation (Ppp): 20W; Breakdown Voltage: 6.1V; Number of Lines: Single channel; Operating Temperature: -40℃~+125℃@(Tj); Type: ESD
D2 = ESD7104MUTAG-ES: Polarity:Unidirectional Reverse Stand-Off Voltage (Vrwm):5V Clamping Voltage:25V Peak Pulse Current (Ipp):4.5A Peak Pulse Power Dissipation (Ppp):120W Voltage - Breakdown:6.5V Reverse Leakage Current (Ir):1uA Number of Channels:4 Operating Temperature:-40; LCSC Part Name: 5.0V4路双向ESD防护器件，5A、20kV、0.4pF；USB3.X/USB4.0/HDMI等高速通讯防护。; Supplier Part: C41429323; Manufacturer: ElecSuper(静芯); Supplier Footprint: DFN2510-10L; Datasheet: https://atta.szlcsc.com/upload/public/pdf/source/20250407/A6F2056571815425D7EFAF408E3DDC0D.pdf; Supplier: LCSC; Polarity: Unidirectional; Reverse Stand-Off Voltage (Vrwm): 5V; Clamping Voltage: 25V; Peak Pulse Current (Ipp): 4.5A; Peak Pulse Power Dissipation (Ppp): 120W; Voltage - Breakdown: 6.5V; Reverse Leakage Current (Ir): 1uA; Number of Channels: 4; Operating Temperature: -40℃~+125℃; Type: ESD; Junction Capacitance: 0.4pF
D3 = BAS70KFILM: Diode Configuration:Single Forward Voltage (Vf@If):1V@15mA Reverse Voltage (Vr):70V Average Rectified Current (Io):70mA Reverse Leakage Current (Ir):10uA@70V; LCSC Part Name: 电压:70V 电流:70mA; Supplier Part: C2798197; Manufacturer: ST(意法半导体); Supplier Footprint: SOD-523; JLCPCB Part Class: Extended Part; Datasheet: https://atta.szlcsc.com/upload/public/pdf/source/20181022/C283251_DA9C3CDC071896BFEB4C9362E62033ED.pdf; Supplier: LCSC; Diode Configuration: Single; Forward Voltage (Vf@If): 1V@15mA; Reverse Voltage (Vr): 70V; Average Rectified Current (Io): 70mA; Reverse Leakage Current (Ir): 10uA@70V
D34 = 1N4007: Supplier Footprint: SMA(DO-214AC); Supplier Part: C727081
H1 = HDR-F_2.54_1x6P: Supplier Footprint: Through
H19 H20 = HDR-F_2.54_1x4P: Supplier Footprint: Through
JP1-JP10 JP16-JP36 = HDR-M_2.54_2x1: Supplier Footprint: Through
L3 = FBMH1608HM601-TV: LCSC Part Name: 单路 0603磁珠 阻抗600Ω@100MHz; Supplier Part: C515368; Manufacturer: TAIYO YUDEN(太诱); Supplier Footprint: 0603; JLCPCB Part Class: Extended Part; Datasheet: https://atta.szlcsc.com/upload/public/pdf/source/20200417/C515365_089FE358CB0A746AF2619FA4531FB460.pdf; Supplier: LCSC; Impedance @ Frequency: 600Ω@100MHz; Tolerance: ±25%; DC Resistance: 170mΩ; Current Rating: 900mA; Circuits: 1
LED1 = LED_0402-B: Supplier Footprint: 0402
LED2 = LED_0402-R: Supplier Footprint: 0402
LED3 = LED_0402-G: Supplier Footprint: 0402
R1 R6 R7 R14-R18 R21 R31 R33-R52 R54-R57 R73-R78 R80-R95 R148-R152 R165-R177 = Res_0603: Supplier Footprint: 0603
SW1 SW2 = Key_SMD_6x6x6.5: Supplier Footprint: SMD
TF1 = M6014-12: Card Connection Mode:- Card Type:MicroSD卡(TF卡) Connector Type:Deck Maximum Body Height:1.85mm Contact Material:- Contact Plating:- Operating Temperature Range:-40℃~+85℃ Operating Temperature Range:-40℃~+85℃ Soldering Temperature(Max):370℃@3S Additional Ca; LCSC Part Name: MicroSD卡(TF卡) 卡座; Supplier Part: C20616645; Manufacturer: MUP(德海威); Supplier Footprint: SMD; JLCPCB Part Class: Extended Part; Datasheet: https://atta.szlcsc.com/upload/public/pdf/source/20240126/D7FE17E0BAFD1A243A2D1FFED735E41D.pdf; Supplier: LCSC; Card Type: MicroSD卡(TF卡); Connector Type: Deck; Maximum Body Height: 1.85mm; Operating Temperature Range: -40℃~+85℃; Soldering Temperature(Max): 370℃@3S; Supplementary Features: 带定位柱
U3 = CX3225CA16000D0HSSCC: Frequency:16MHz Normal temperature Frequency Tolerance:±20ppm Normal temperature Frequency Tolerance:±20ppm Load Capacitor: Frequency Stability(Full temperature range):±50ppm Frequency Stability(Full temperature range):±50ppm Equivalent Series Resistance; LCSC Part Name: 16MHz ±20ppm 8pF; Supplier Part: C1985248; Manufacturer: Kyocera AVX; Supplier Footprint: SMD3225-4P; JLCPCB Part Class: Extended Part; Datasheet: https://atta.szlcsc.com/upload/public/pdf/source/20210701/33FBE0FD6FD9FCA81EEEC961B7B4FAE9.pdf; Supplier: LCSC; Normal temperature Frequency Tolerance: ±20ppm; Frequency Stability(Full temperature range): ±50ppm; Equivalent Series Resistance (ESR): 100Ω
U5 = FM25V02A-G: LCSC Part Name: FM25V02A G; Supplier Part: C1348831; Supplier Footprint: SOIC-8; JLCPCB Part Class: Extended Part; Supplier: LCSC
U15 U32 = TJA1051TK/3,118: Type:Transceiver Data Rate:5Mbps Supply Voltage:4.5V~5.5V Supply Voltage:4.5V~5.5V; LCSC Part Name: 5Mbps 4.5V~5.5V; Supplier Part: C124020; Manufacturer: NXP(恩智浦); Supplier Footprint: HVSON-8-EP(3x3); JLCPCB Part Class: Extended Part; Datasheet: https://atta.szlcsc.com/upload/public/pdf/source/20170810/C124020_1502335225901879762.pdf; Supplier: LCSC; Type: Transceiver; Data Rate: 5Mbps; Supply Voltage: 4.5V~5.5V
U16 = LP5907UVX-4.5/NOPB: Supplier Part: C2879580; Supplier Footprint: DSBGA-4; JLCPCB Part Class: Extended Part; Supplier: LCSC
U28 = STM32H753IIK6: LCSC Part Name: 带DSP和DP-FPU的高性能ARM Cortex-M7 MCU，具有2 MB Flash、1 MB RAM、480 MHz CPU、ART加速器、一级缓存、外部存储器接口、包括加密加速器在内的大量外设以及安全服务支持; Supplier Part: C730205; Manufacturer: ST(意法半导体); Supplier Footprint: UFBGA-176; JLCPCB Part Class: Extended Part; Datasheet: https://item.szlcsc.com/datasheet/STM32H753IIK6/778160.html; Supplier: LCSC; CPU Core: ARM Cortex-M Series; CPU Maximum Speed: 480MHz; Number of I/O: 140; ADC (Bit): 16bit; DAC (Bit): 12bit; Voltage - Supply: 1.62V~3.6V
U17 U19 U30 = SM06B-SRSS-TB: Pins Structure:1x6P Pitch:1mm Mounting Type:Horizontal attachment Reference Series:SH Number of Pins:6P Number of Rows:1 Number of PINs Per Row:6 Row Spacing:- Current Rating:1A Contact Material:Copper alloy Contact Plating:Tin Operating Temperature:-25℃~; LCSC Part Name: 1x6P 间距:1mm 卧贴 系列:SH; Supplier Part: C7588156; Manufacturer: JST; Supplier Footprint: SMD,P=1mm,卧贴; JLCPCB Part Class: Extended Part; Datasheet: https://atta.szlcsc.com/upload/public/pdf/source/20220125/8D1415C84023CDA874F833913395E8A2.pdf; Supplier: LCSC; Pins Structure: 1x6P; Pitch: 1mm; Mounting Type: Horizontal attachment; Reference Series: SH; Number of Pins: 6P; Number of Rows: 1; Number of PINs Per Row: 6; Current Rating: 1A; Contact Material: Copper alloy; Contact Plating: Tin; Operating Temperature: -25℃~+85℃; Voltage Rating: 50V; Plastic Material: PA; Flame Retardant Rating: UL94V-0; Supplementary Features: Auxiliary soldering legs; Color: White; Z-Height of the Board: 2.9mm; X-Length of Bottom Edge on Board (Spacing Line): 8mm; Y-Width of Bottom Edge on Board: 4.32mm
U52 = MS621FE-FL11E: LCSC Part Name: Seiko(精工) 锂离子电池 3V 5.5mAh 1个; Supplier Part: C80909; Manufacturer: Seiko(精工); Datasheet: https://item.szlcsc.com/datasheet/MS621FE-FL11E/82059.html; Supplier: LCSC; nominal voltage: 3V; Capacity: 5.5mAh; diameter: 6.8mm; thickness: 2.2mm; Chemical system: Lithium-ion; Type: Battery; Battery Rechargeability: Rechargeable; unit: 1 Piece
X1 = Q13FC13500004_C32346: Crystal Type:Surface Mount Crystal Frequency: Normal temperature Frequency Tolerance:±20ppm Normal temperature Frequency Tolerance:±20ppm Load Capacitor: Equivalent Series Resistance (ESR):70kΩ Operating Temperature: Operating Temperature:; LCSC Part Name: 32.768kHz ±20ppm 12.5pF; Supplier Part: C32346; Manufacturer: EPSON(爱普生); Manufacturer Part: Q13FC13500004; Supplier Footprint: SMD3215-2P; JLCPCB Part Class: Basic Part; Datasheet: https://atta.szlcsc.com/upload/public/pdf/source/20240418/0E0FF5F0356BA3753F616001439D1416.pdf; Supplier: LCSC; Crystal Type: Surface Mount Crystal; Normal temperature Frequency Tolerance: ±20ppm; Equivalent Series Resistance (ESR): 70kΩ
D7-D10 = TPD1E01B04DPYT: Reverse Stand-Off Voltage (Vrwm):3.6V Maximum Clamping Voltage:15V Peak Pulse Current (Ipp)@10/1000us:2.5A@(8/20us) Peak Pulse Power Dissipation (Ppp)@10/1000us:27W Breakdown Voltage:6.4V Operating Temperature:-40℃~+125℃@(Ta) Operating Temperature:-40℃~+1; Supplier Part: C1973299; Manufacturer: TI(德州仪器); Supplier Footprint: X1-SON-2(0.6x1); JLCPCB Part Class: Extended Part; Datasheet: https://www.ti.com/cn/lit/gpn/tpd1e01b04; Supplier: LCSC; Reverse Stand-Off Voltage (Vrwm): 3.6V; Maximum Clamping Voltage: 15V; Peak Pulse Current (Ipp)@10/1000us: 2.5A@(8/20us); Peak Pulse Power Dissipation (Ppp)@10/1000us: 27W; Breakdown Voltage: 6.4V; Operating Temperature: -40℃~+125℃@(Ta); Type: ESD
Q1-Q3 = NTHD4102PT1G: Type:2 P-Channel Drain Source Voltage (Vdss): Continuous Drain Current (Id): Power Dissipation (Pd): Drain Source On Resistance (RDS(on)@Vgs,Id):80mΩ@4.5V,2.9A Gate Threshold Voltage (Vgs(th)@Id):; LCSC Part Name: 2个P沟道 耐压:20V 电流:2.9A; Supplier Part: C145141; Supplier Footprint: ChipFET; JLCPCB Part Class: Extended Part; Supplier: LCSC; Type: 2 P-Channel; Drain Source On Resistance (RDS(on)@Vgs,Id): 80mΩ@4.5V,2.9A
U9 = USB-3.1插座TYPE-C母座: Supplier Part: C9900005891; Supplier Footprint: TYPE-C母座16P贴片; JLCPCB Part Class: Extended Part; Supplier: LCSC
U18 = LTC4417IUF#PBF: LCSC Part Name: 确定了优先级的 PowerPath™ 控制器; Supplier Part: C580907; Manufacturer: ADI(亚德诺); Supplier Footprint: QFN-24-EP(4x4); JLCPCB Part Class: Extended Part; Datasheet: https://atta.szlcsc.com/upload/public/pdf/source/20170712/C117306_1499832377608814489.pdf; Supplier: LCSC
U29 = NUF2042XV6T1G: Supplier Part: C90707; Manufacturer: onsemi(安森美); Supplier Footprint: SOT-563; JLCPCB Part Class: Extended Part; Datasheet: https://atta.szlcsc.com/upload/public/pdf/source/20221020/EA5241A61CFA6E196F125BE50C842EA7.pdf; Supplier: LCSC; Filter Order: 2; ESD Protection: Yes; Number of Channels: 2; OperatingTemperature: -55℃~+125℃
C78 C158 C180 C186 C192 C198 = NFM18PC104R1C3D: Nominal Capacitance:100nF CapacitanceTolerance:±20% CapacitanceTolerance:±20% DC Rated Voltage:16V Rated Current:2A DC Resistance:30mΩ Operating Temperature:-55℃~+125℃ Operating Temperature:-55℃~+125℃; LCSC Part Name: 100nF(104) ±20% 16V; Supplier Part: C111493; Manufacturer: muRata(村田); Supplier Footprint: SMD-3P,0.8x1.6mm; JLCPCB Part Class: Extended Part; Datasheet: https://atta.szlcsc.com/upload/public/pdf/source/20170511/1494500112197.pdf; Supplier: LCSC; Nominal Capacitance: 100nF; CapacitanceTolerance: ±20%; DC Rated Voltage: 16V; Rated Current: 2A; DC Resistance: 30mΩ; Operating Temperature: -55℃~+125℃
L1 = L_0402
U20 U23 = BQ24315DSGR: Supplier Part: C330400; Manufacturer: TI(德州仪器); Supplier Footprint: WSON-8-EP(2x2); JLCPCB Part Class: Extended Part; Datasheet: https://www.ti.com/cn/lit/gpn/bq24315; Supplier: LCSC
U26 = TPS62903QRYTRQ1_C20345985: Function:Step-down type Output Type:- Voltage - Supply:3V~18V Voltage - Supply:3V~18V Output Voltage:- Output Voltage:- Output Current:3A Frequency - Switching:1MHz；2.5MHz Frequency - Switching:1MHz；2.5MHz Operating Temperature:-40℃~+165℃ Operating Temper; LCSC Part Name: 3V至18V、3A汽车级低IQ降压转换器; Supplier Part: C20345985; Manufacturer: TI(德州仪器); Supplier Footprint: VQFN-9(2.2x2); JLCPCB Part Class: Extended Part; Datasheet: https://item.szlcsc.com/datasheet/TPS62903QRYTRQ1/21671513.html; Supplier: LCSC; Function: Step-down type; Voltage - Supply: 3V~18V; Output Current: 3A; Frequency - Switching: 1MHz；2.5MHz; Operating Temperature: -40℃~+165℃; Synchronous Rectifier: Yes; Number of Outputs: 1; Topology: Step-down; Switch tube (built-in/external): Built-in
U27 = TPS7A9201DSKR: Output Type:Adjustable Maximum Input Voltage:6.5V Output Voltage:800mV~5.2V Output Voltage:800mV~5.2V Output Current:2A Power Supply Rejection Ratio (PSRR):40dB@(1MHz) Operating Temperature:-40℃~+125℃@(Tj) Operating Temperature:-40℃~+125℃@(Tj); LCSC Part Name: 2A、低噪声、高 PSRR、高精度、可调节超低压降稳压器; Supplier Part: C882405; Manufacturer: TI(德州仪器); Supplier Footprint: DFN-10-EP(2.6x2.6); JLCPCB Part Class: Extended Part; Datasheet: https://www.ti.com/cn/lit/gpn/tps7a92; Supplier: LCSC; Output Type: Adjustable; Maximum Input Voltage: 6.5V; Output Voltage: 800mV~5.2V; Output Current: 2A; Power Supply Rejection Ratio (PSRR): 40dB@(1MHz); Operating Temperature: -40℃~+125℃@(Tj)
U42 U43 = MIC5332-SSYMT-TR: LCSC Part Name: 输入5.5V 输出3.3V 300mA; Supplier Part: C153276; Manufacturer: MICROCHIP(美国微芯); Supplier Footprint: MLF-8(2x2); JLCPCB Part Class: Extended Part; Datasheet: https://atta.szlcsc.com/upload/public/pdf/source/20171228/C153276_15144475830431215029.pdf; Supplier: LCSC; Output Type: Fixed; Maximum Input Voltage: 5.5V; Output Voltage: 3.3V; Output Current: 300mA; Power Supply Rejection Ratio (PSRR): 65dB; Dropout Voltage: 240mV@(300mA); standby current: 50uA; Feature: ESD Protection；Thermal Protection(TSD)；Overcurrent Protection(OCP)；With ability; Operating Temperature: -40℃~+125℃; Output Polarity: Positive electrode; Number of Outputs: 2
U48-U51 = LP5907MFX-3.3/NOPB: LCSC Part Name: 具有低 IQ 和使能功能的 250mA、低噪声、高 PSRR、超低压降稳压器; Supplier Part: C80670; Manufacturer: TI(德州仪器); Supplier Footprint: SOT-23-5; JLCPCB Part Class: Extended Part; Datasheet: https://www.ti.com/cn/lit/gpn/lp5907; Supplier: LCSC; Output Type: Fixed; Maximum Input Voltage: 5.5V; Output Voltage: 3.3V; Output Current: 250mA; Power Supply Rejection Ratio (PSRR): 90dB@(100Hz)；60dB@(100kHz); Dropout Voltage: 250mV@(250mA); standby current: 25uA; Feature: ESD Protection；Short-Circuit  Protection；Automatic Discharge Function；Low ESR；Thermal Protection(TSD)；Under-voltage Lockout；With ability; Operating Temperature: -40℃~+125℃; Output Polarity: Positive electrode; Number of Outputs: 1
U13 U33 = BMP388: Pressure range:30Kpa~125Kpa Pressure range:30Kpa~125Kpa Voltage - Supply:1.65V~3.6V Voltage - Supply:1.65V~3.6V Operating Temperature:- Operating Temperature:-; Supplier Part: C779278; Manufacturer: Bosch(博世); Supplier Footprint: LGA-10(2x2); JLCPCB Part Class: Extended Part; Datasheet: https://atta.szlcsc.com/upload/public/pdf/source/20211019/91C230A1D32F1E776DA878FFB43C8B15.pdf; Supplier: LCSC; Pressure range: 30Kpa~125Kpa; Voltage - Supply: 1.65V~3.6V
U31 = ICM-20649: LCSC Part Name: ICM-20649 停产; Supplier Part: C475538; Manufacturer: TDK InvenSense(应美盛); Supplier Footprint: QFN-24(3x3); JLCPCB Part Class: Extended Part; Datasheet: https://atta.szlcsc.com/upload/public/pdf/source/20200318/C475538_DE75CFF9D9E7EA8ABE3959AC21876D5D.pdf; Supplier: LCSC; Sensor Type: Accelerometer Gyroscope; Operating Temperature: -40℃~+85℃
H4 H5 H21-H23 = HDR-M_2.54_1x1P: Supplier Footprint: Through
U12 = BMI088: Sensor Type:加速度计陀螺仪 Operating Temperature:-40℃~+85℃ Operating Temperature:-40℃~+85℃; Supplier Part: C194919; Manufacturer: Bosch(博世); Supplier Footprint: LGA-16(3x4.5); JLCPCB Part Class: Extended Part; Datasheet: https://atta.szlcsc.com/upload/public/pdf/source/20180628/C194919_66CCF125FF968C218A4D358C68AC68D6.pdf; Supplier: LCSC; Sensor Type: 加速度计陀螺仪; Operating Temperature: -40℃~+85℃
U14 = BMM150: LCSC Part Name: 三轴地磁式传感器 停产; Supplier Part: C171681; Manufacturer: Bosch(博世); Supplier Footprint: WLCSP-12(1.6x1.6); JLCPCB Part Class: Extended Part; Datasheet: https://atta.szlcsc.com/upload/public/pdf/source/20180327/C171681_AC95244FE88EF9D8F701E0ABF38F9AC1.pdf; Supplier: LCSC
U34 = ICM-42688-P: Supplier Part: C1850418; Manufacturer: TDK InvenSense(应美盛); Supplier Footprint: LGA-14(2.5x3); JLCPCB Part Class: Extended Part; Datasheet: https://atta.szlcsc.com/upload/public/pdf/source/20210703/CF24204867ACE5B754A2B035F23E5931.pdf; Supplier: LCSC; Sensor Type: Accelerometer gyroscope
U35 = 24AA64-I/SN: Supplier Part: C615136; Supplier Footprint: SOIC-8; JLCPCB Part Class: Extended Part; Supplier: LCSC

## Nets
GND: C1.2 C2.2 C3.2 C4.2 C5.2 C12.2 C13.2 C14.2 C15.2 C16.2 C17.2 C18.2 C19.2 C20.2 C21.2 C22.2 C23.2 C24.2 C25.2 C33.2 C34.2 C35.1 C36.2 C37.2 C38.2 C39.1 C40.2 C41.1 C42.1 C43.2 C44.2 C45.2 C46.2 C47.2 C48.2 C49.2 C50.2 C51.2 C52.2 C53.2 C54.2 C55.2 C58.2 C59.1 C60.2 C61.2 C66.1 C67.2 C68.2 C78.2(GND) C86.2 C87.2 C88.2 C89.2 C90.2 C91.2 C92.1 C93.1 C94.2 C95.1 C96.2 C97.1 C98.2 C99.2 C100.2 C101.2 C102.2 C103.1 C104.1 C150.2 C151.2 C152.2 C153.2 C154.2 C156.2 C157.2 C158.2(GND) C159.2 C160.2 C161.2 C162.2 C163.2 C180.2(GND) C181.2 C182.2 C183.2 C184.2 C185.2 C186.2(GND) C187.2 C188.2 C189.2 C190.2 C191.2 C192.2(GND) C193.2 C194.2 C195.2 C196.2 C197.2 C198.2(GND) C199.2 C200.2 C201.2 C202.2 C203.2 CN11.4 CN11.5 CN11.6 CN13.4 CN13.5 CN13.6 CN14.4 CN14.5 CN14.6 D1.2(A) D2.3(GND) D2.8(GND) D7.2 D8.2 D9.2 D10.2 H1.6 H19.4 H20.4 LED3.1(C) R1.1 R21.1 R37.1 R40.1 R43.1 R44.2 R51.1 R56.1 R73.1 R75.1 R78.1 R89.1 R149.1 R152.1 R165.1 R167.1 R168.1 R170.1 R171.1 R173.1 R174.1 R176.1 SW2.3 SW2.4 TF1.6(VSS) TF1.10(GND) TF1.11(GND) TF1.12(GND) TF1.13(GND) U3.2(NC) U3.4(NC) U5.4(VSS) U9.1(GND) U9.2(GND) U9.3(GND) U9.4(GND) U9.A1B12(GND) U9.B1A12(GND) U12.2(NC) U12.4(GNDA) U12.6(GNDIO) U12.7(PS) U13.3(VSS) U13.5(SDO) U13.8(VSS) U13.9(VSS) U14.A1(PS) U14.A5(CSB) U14.C1(SDO) U14.C5(GND) U14.E1(GND) U14.E3(GND) U15.2(GND) U15.8(S) U15.9(EP) U16.B2(GND) U17.5 U17.6 U17.7 U17.8 U18.10(GND) U18.25(EP) U19.5 U19.6 U19.7 U19.8 U20.2(VSS) U20.6(VBAT) U20.9(EP) U23.2(VSS) U23.6(VBAT) U23.9(EP) U26.4(GND) U27.4(GND) U27.11(EP) U28.D5(VSS) U28.D7(VSS) U28.D8(VSS) U28.D9(VSS) U28.F2(VSS) U28.F6(VSS) U28.F7(VSS) U28.F8(VSS) U28.F9(VSS) U28.F10(VSS) U28.F12(VSS) U28.G2(VSS) U28.G6(VSS) U28.G7(VSS) U28.G8(VSS) U28.G9(VSS) U28.G10(VSS) U28.G12(VSS) U28.H6(VSS) U28.H7(VSS) U28.H8(VSS) U28.H9(VSS) U28.H10(VSS) U28.H12(VSS) U28.J6(VSS) U28.J7(VSS) U28.J8(VSS) U28.J9(VSS) U28.J10(VSS) U28.K6(VSS) U28.K7(VSS) U28.K8(VSS) U28.K9(VSS) U28.K10(VSS) U28.L4(VSS) U28.M1(VSSA) U28.M8(VSS) U28.M9(VSS) U29.2(GND) U30.6 U30.7 U30.8 U31.18(GND) U31.20(RESV) U31.25(EP) U32.2(GND) U32.8(S) U32.9(EP) U33.3(VSS) U33.8(VSS) U33.9(VSS) U34.6(GND) U35.1(A0) U35.2(A1) U35.3(A2) U35.4(VSS) U35.7(WP) U42.2(GND) U42.9(EP) U43.2(GND) U43.5(EN1) U43.9(EP) U48.2(GND) U49.2(GND) U50.2(GND) U51.2(GND) U52.2(-) ; also on sheet 7 8 9 10 11
VBAT: C23.1 R177.2 U28.C1(VBAT) U52.1(+) ; also on sheet 10
VBUS: CN13.1 Q3.7(D1) Q3.8(D1) U9.A4B9(VBUS) U9.B4A9(VBUS) U29.5(VBUS)
VBUS_SENSE: U28.E15(PA9)
VDD5V_BRICK1: C45.1 C46.1 Q1.7(D1) Q1.8(D1) R35.2 U17.1 U17.2 U18.21(V1)
VDD5V_BRICK2: C53.1 C54.1 Q2.7(D1) Q2.8(D1) R38.2 U18.20(V2) U19.1 U19.2
VDD_3V3_SD_CARD_EN: U16.B1(EN) U28.D1(PC13)
VDD_3V3_SENSORS1: C92.2 C94.1 C185.1 R166.2 U31.8(VDDIO) U31.13(VDD) U48.5(OUT)
VDD_3V3_SENSORS1_EN: R165.2 U28.E4(PI11) U48.3(EN)
VDD_3V3_SENSORS2: C36.1 C99.1 C100.1 C101.1 C191.1 R169.2 U13.1(VDDIO) U13.6(CSB) U34.5(VDDIO) U34.8(VDD) U49.5(OUT)
VDD_3V3_SENSORS2_EN: R168.2 U28.J3(PF4) U49.3(EN)
VDD_3V3_SENSORS3: C33.1 C34.1 C197.1 R172.2 U12.3(VDD) U12.11(VDDIO) U50.5(OUT)
VDD_3V3_SENSORS3_EN: R171.2 U28.R8(PE7) U50.3(EN)
VDD_3V3_SENSORS4: C37.1 C38.1 C98.1 C102.1 C203.1 R175.2 U14.B2(VDDIO) U14.E5(VDD) U33.1(VDDIO) U33.5(SDO) U33.6(CSB) U35.8(VCC) U51.5(OUT)
VDD_3V3_SENSORS4_EN: R174.2 U28.H14(PG8) U51.3(EN)
VDD_3V3_SPEKTRUM: C153.1 C154.1 U42.8(VOUT1) ; also on sheet 11
VDD_3V3_SPEKTRUM_EN: R148.1 R149.2 U42.5(EN1) ; also on sheet 10
VDD_3V3_SPEKTRUM_POWER_EN: R148.2 U28.F4(PH2)
VDD_5V_HIPOWER: C67.1 C68.1 U23.8(OUT) ; also on sheet 8
VDD_5V_HIPOWER_NEN: R55.1 U28.B10(PG10)
VDD_5V_HIPOWER_NOC: R54.1 R57.1 U28.N6(PF13)
VDD_5V_IN: C47.1 C48.1 C59.2 C66.2 C78.1(IN) C86.1 C158.1(IN) C180.1(IN) C183.1 C184.1 C186.1(IN) C189.1 C190.1 C192.1(IN) C195.1 C196.1 C198.1(IN) C201.1 C202.1 H19.1 Q1.5(D2) Q1.6(D2) Q2.5(D2) Q2.6(D2) Q3.5(D2) Q3.6(D2) R88.2 U18.12(VOUT) U20.1(IN) U23.1(IN) U26.5(EN) U26.6(VIN) ; also on sheet 10
VDD_5V_PERIPH: C60.1 C61.1 CN11.1 CN14.1 H20.1 U20.8(OUT) ; also on sheet 8
VDD_5V_PERIPH_NEN: R50.1 U28.K14(PG4)
VDD_5V_PERIPH_NOC: R49.1 R52.1 U28.R11(PE15)
VDD_BUCK_OUT: C87.1 C89.1 L1.2 R74.2 R76.2 U26.3(VOS) U27.6(SS_CTRL) U27.9(IN) U27.10(IN)
VDDA: C24.1 C25.1 L3.2 U28.R1(VDDA)
16_MHZ_IN: C1.1 U3.1(HOT) U28.G1(PH0-OSC_IN)
16_MHZ_OUT: C2.1 U3.3(HOT) U28.H1(PH1-OSC_OUT)
24AA64_SCL: JP36.2 U35.6(SCL)
24AA64_SDA: JP35.2 U35.5(SDA)
32KHZ_IN: C3.1 U28.E1(PC14-OSC32_IN) X1.1
32KHZ_OUT: C4.1 U28.F1(PC15-OSC32_OUT) X1.2
ADC3_3V3: U28.M5(PC3_C)
ADC3_6V6: U28.M4(PC2_C)
BMI088_CSB_ACCEL: JP19.2 U12.14(CSB1)
BMI088_CSB_GYRO: JP20.2 U12.5(CSB2)
BMI088_INT1_ACCEL: JP21.2 U12.16(INT1)
BMI088_INT2_ACCEL: H4.1 U12.1(INT2)
BMI088_INT3_GYRO: JP22.2 U12.12(INT3)
BMI088_INT4_GYRO: H5.1 U12.13(INT4)
BMI088_MISO: JP17.2 U12.10(SDO2) U12.15(SDO1)
BMI088_MOSI: JP18.2 U12.9(SDA/SDI)
BMI088_SCK: JP16.2 U12.8(SCL/SCK)
BMM150_DRY: H22.1 U14.D4(DRY)
BMM150_INT: H23.1 U14.D2(INT)
BMM150_SCL: JP34.2 U14.A3(SCK)
BMM150_SDA: JP33.2 U14.B4(SDI)
BMP388_INT: JP25.2 U13.7(INT)
BMP388_SCL: JP24.2 JP27.2 U13.2(SCK) U33.2(SCK)
BMP388_SDA: JP23.2 JP26.2 U13.4(SDI) U33.4(SDI)
BOOT0: R1.2 SW1.3 SW1.4 U28.D6(BOOT0)
BUCK_PG: R76.1 U26.1(PG) U27.7(EN)
BUZZER_1: U28.L2(PF9) ; also on sheet 8
CAN1_RX: U15.4(RXD) U28.B12(PD0)
CAN1_TX: U15.1(TXD) U28.C12(PD1)
CAN2_RX: U28.P12(PB12) U32.4(RXD)
CAN2_TX: U28.P13(PB13) U32.1(TXD)
CANH: H19.2 H20.2
CANL: H19.3 H20.3
ETH_CRS_DV: U28.R3(PA7) ; also on sheet 7
ETH_MDC: U28.M3(PC1) ; also on sheet 7
ETH_MDIO: U28.P2(PA2) ; also on sheet 7
ETH_NRESET: C162.1 R151.2 U43.3(POR2) ; also on sheet 7
ETH_POWER_EN: R152.2 U28.B7(PG15) U43.4(EN2) ; also on sheet 7
ETH_REF_CLK: U28.N2(PA1) ; also on sheet 7
ETH_RXD0: U28.N5(PC4) ; also on sheet 7
ETH_RXD1: U28.P5(PC5) ; also on sheet 7
ETH_TX_EN: U28.R13(PB11) ; also on sheet 7
ETH_TXD0: U28.A8(PG13) ; also on sheet 7
ETH_TXD1: U28.B8(PG12) ; also on sheet 7
ETH_VDD_5V: C158.3(OUT) C163.1 U43.1(VIN)
ETH_VDD_IO_3V3: C159.1 C160.1 R151.1 U43.7(VOUT2) ; also on sheet 7
FMU_CAP1: U28.P10(PE11)
FMU_CH1: U28.E14(PI0) ; also on sheet 9
FMU_CH2: U28.K12(PH12) ; also on sheet 9
FMU_CH3: U28.L12(PH11) ; also on sheet 9
FMU_CH4: U28.L13(PH10) ; also on sheet 9
FMU_CH5: U28.M15(PD13) ; also on sheet 9
FMU_CH6: U28.M14(PD14) ; also on sheet 9
FMU_CH7: U28.M11(PH6) ; also on sheet 9
FMU_CH8: U28.M13(PH9) ; also on sheet 9
FMU_NRST: C5.1 D1.1(K) SW2.1 SW2.2 U28.J1(NRST)
FMU_NSAFETY_SWITCH_LED_OUT: U28.N15(PD10) ; also on sheet 8
FMU_PPM_INPUT: U28.C4(PI5)
FMU_SAFETY_SWITCH_IN: U28.K3(PF5) ; also on sheet 8
FMU_SWCLK: D2.5(I/O) D2.6(NC) H1.5 U28.A14(PA14) U30.5
FMU_SWDIO: D2.4(I/O) D2.7(NC) H1.4 U28.A15(PA13) U30.4
FMU_VDD_3V3: C12.1 C13.1 C14.1 C15.1 C16.1 C17.1 C18.1 C19.1 C20.1 C21.1 C22.1 C39.2 C40.1 C41.2 C91.1 C95.2 C96.1 D34.2(A) H1.1 L3.1 R6.2 R7.2 R14.2 R15.2 R16.2 R17.2 R18.2 R52.2 R57.2 R77.2 R80.2 R81.2 R84.2 R85.2 R86.2 R90.2 R91.2 R92.2 R93.2 R94.2 R95.2 SW1.1 SW1.2 U5.8(VDD) U15.3(VCC) U15.5(VIO) U16.A1(IN) U27.1(OUT) U27.2(OUT) U28.C5(VDD) U28.C6(PDR_ON) U28.C7(VDD) U28.C8(VDD) U28.C9(VDD) U28.F3(VDD) U28.G3(VDD) U28.G13(VDD) U28.J12(VDD) U28.J13(VDD) U28.K4(VDD) U28.N8(VDD) U28.N9(VDD) U28.N10(VDD) U30.1 U32.3(VCC) U32.5(VIO) ; also on sheet 8
FRAM_CSN: JP4.2 U5.1(CS#)
FRAM_MISO: JP3.2 U5.2(SO)
FRAM_MOSI: JP2.2 U5.5(SI)
FRAM_SCK: JP1.2 U5.6(SCK)
HEATER: U28.R12(PB10)
HW_REV_SENSE: R81.1 R83.2 U28.H4(PH4)
HW_VER_REV_DRIVE: R82.1 R83.1 U28.N7(PG0)
HW_VER_SENSE: R80.1 R82.2 U28.G4(PH3)
I2C1_SCL_BASE_GPS1_MAG_LED_PM1: R34.2 R90.1 U28.A5(PB8) ; also on sheet 8
I2C1_SDA_BASE_GPS1_MAG_LED_PM1: R33.2 R91.1 U28.B4(PB9) ; also on sheet 8
I2C2_DRDY1_BMP388: JP25.1 U28.K13(PG5)
I2C2_SCL_BASE_GPS2_MAG_LED_PM2: JP24.1 R46.2 R92.1 U28.H3(PF1) ; also on sheet 8
I2C2_SDA_BASE_GPS2_MAG_LED_PM2: JP23.1 R45.2 R93.1 U28.E2(PF0) ; also on sheet 8
I2C3_SCL_BASE_MS5611_BARBED_EXTERNAL1: U28.F15(PA8) ; also on sheet 8
I2C3_SDA_BASE_MS5611_BARBED_EXTERNAL1: U28.M12(PH8) ; also on sheet 8
I2C4_SCL_FMU: JP27.1 JP34.1 JP36.1 R95.1 U28.R7(PF14)
I2C4_SDA_FMU: JP26.1 JP33.1 JP35.1 R94.1 U28.P7(PF15)
ICM20649_FSYNC: JP9.2 U31.11(FSYNC)
ICM20649_INT1: JP10.2 U31.12(INT1)
ICM20649_MISO: JP6.2 U31.9(SDO/AD0)
ICM20649_MOSI: JP5.2 U31.24(SDA/SDI)
ICM20649_NCS: JP8.2 U31.22(nCS)
ICM20649_SCLK: JP7.2 U31.23(SCL/SCLK)
ICM42688_CS: JP31.2 U34.12(AP_CS)
ICM42688_INT1: H21.1 U34.4(INT1/INT)
ICM42688_INT2: JP32.2 U34.9(INT2/FSYNC/CLKIN)
ICM42688_MISO: JP29.2 U34.1(AP_SDO/AP_AD0)
ICM42688_MOSI: JP30.2 U34.14(AP_SDA/AP_SDIO/AP_SDI)
ICM42688_SCK: JP28.2 U34.13(AP_SCL/AP_SCLK)
IO_NRST: C152.1 R150.1 U42.3(POR2) ; also on sheet 10
IO_VDD_3V3: C156.1 C157.1 R150.2 U42.7(VOUT2) ; also on sheet 10
IO_VDD_5V: C78.3(OUT) C150.1 U42.1(VIN) U42.4(EN2)
N_FMU_RESET: U27.5(PG)
NARMED: U28.B3(PE6)
NFC_GPIO: U28.M2(PC0) ; also on sheet 8
NLED_BLUE: LED2.2(C) U28.B2(PE5)
NLED_GREEN: U28.B1(PE4)
NLED_RED: LED1.1(C) U28.A1(PE3)
NPOWER_IN_A: U18.7(VALID1#) U28.M7(PG1)
NPOWER_IN_B: U18.8(VALID2#) U28.L15(PG2)
NPOWER_IN_C: U18.9(VALID3#) U28.K15(PG3)
P_P_S_G1: Q1.2(G1) Q1.4(G2) U18.17(G1)
P_P_S_G2: Q2.2(G1) Q2.4(G2) U18.15(G2)
P_P_S_G3: Q3.2(G1) Q3.4(G2) U18.13(G3)
P_P_S_VS1: C49.1 Q1.1(S1) Q1.3(S2) U18.18(VS1)
P_P_S_VS2: C55.1 Q2.1(S1) Q2.3(S2) U18.16(VS2)
P_P_S_VS3: C58.1 Q3.1(S1) Q3.3(S2) U18.14(VS3)
PD15(PH11): U28.L14(PD15)
PG6: U28.J15(PG6)
RX_DEBUG_CATHODE: D2.2(I/O) D2.9(NC) D3.1(K) H1.3 U30.3
SCALED_V5: R88.1 R89.2 U28.R4(PB1)
SCALED_VDD_3V3_SENSORS1: R166.1 R167.2 U28.N3(PA0)
SCALED_VDD_3V3_SENSORS2: R169.1 R170.2 U28.N4(PA4)
SCALED_VDD_3V3_SENSORS3: R172.1 R173.2 U28.R5(PB0)
SCALED_VDD_3V3_SENSORS4: R175.1 R176.2 U28.P6(PF12)
SDMMC2_CLK: TF1.5(CLK) U28.B11(PD6)
SDMMC2_CMD: R16.1 TF1.3(CMD) U28.A11(PD7)
SDMMC2_D0: R17.1 TF1.7(DAT0) U28.R14(PB14)
SDMMC2_D1: R18.1 TF1.8(DAT1) U28.R15(PB15)
SDMMC2_D2: R14.1 TF1.1(DAT2) U28.B9(PG11)
SDMMC2_D3: R15.1 TF1.2(CD/DAT3) U28.A9(PB4)
SPI1_DRDY1_ICM20602: JP10.1 U28.H2(PF2)
SPI1_MISO_SENSOR1_ICM20602: JP6.1 U28.C10(PG9)
SPI1_MOSI_SENSOR1_ICM20602: JP5.1 U28.A6(PB5)
SPI1_NCS1_ICM20602: JP8.1 U28.D3(PI9)
SPI1_SCK_SENSOR1_ICM20602: JP7.1
SPI1_SCK_SENSORS1_ICM20602: U28.P4(PA5)
SPI2_DRDY2_ISM330_INT2: JP32.1 U28.D15(PA10)
SPI2_MISO_SENSOR2_ISM330: JP29.1 U28.C14(PI2)
SPI2_MOSI_SENSOR2_ISM330: JP30.1 U28.C13(PI3)
SPI2_NCS1_ISM330: JP31.1 U28.J4(PH5)
SPI2_SCK_SENSOR2_ISM330: JP28.1 U28.D14(PI1)
SPI3_DRDY1_BMI088_INT1_ACCEL: JP21.1 U28.C3(PI6)
SPI3_DRDY2_BMI088_INT3_GYRO: JP22.1 U28.C2(PI7)
SPI3_MISO_SENSOR3_BMI088: JP17.1 U28.B13(PC11)
SPI3_MOSI_SENSOR3_BMI088: JP18.1 U28.M6(PB2)
SPI3_NCS1_BMI088_ACCEL: JP19.1 U28.D4(PI4)
SPI3_NCS2_BMI088_GYRO: JP20.1 U28.D2(PI8)
SPI3_SCK_SENSOR3_BMI088: JP16.1 U28.B14(PC10)
SPI4_DRDY1_BMM150_DRDY: U28.J2(PF3)
SPI4_MISO_SENSOR4_BMM150: U28.N11(PE13)
SPI4_MOSI_SENSOR4_BMM150: U28.P11(PE14)
SPI4_NCS1_BMM150: U28.D13(PH15)
SPI4_SCK_SENSOR4_BMM150: U28.R10(PE12)
SPI5_MISO_FRAM: JP3.1 U28.N12(PH7)
SPI5_MOSI_FRAM: JP2.1 U28.R6(PF11)
SPI5_NCS1_FRAM: JP4.1 U28.J14(PG7)
SPI5_SCK_FRAM: JP1.1 U28.K1(PF7)
SPI6_DRDY1_EXTERNAL1: U28.N14(PD11)
SPI6_DRDY2_EXTERNAL1: U28.N13(PD12)
SPI6_MISO_EXTERNAL1: U28.P3(PA6)
SPI6_MOSI_EXTERNAL1: U28.A7(PG14)
SPI6_NCS1_EXTERNAL1: U28.E3(PI10)
SPI6_NCS2_EXTERNAL1: U28.A13(PA15)
SPI6_NRESET_EXTERNAL1: U28.L1(PF10)
SPI6_SCK_EXTERNAL1: U28.A10(PB3)
SPIX_SYNC: JP9.1 U28.P9(PE9)
TRACECLK: U28.A2(PE2)
UART4_RX: U28.E13(PH14) ; also on sheet 8
UART4_TX: U28.E12(PH13) ; also on sheet 8
UART5_CTS_TELEM2: U28.F14(PC9) ; also on sheet 8
UART5_RTS_TELEM2: U28.G14(PC8) ; also on sheet 8
UART5_RX_TELEM2: U28.D12(PD2) ; also on sheet 8
UART5_TX_TELEM2: U28.A12(PC12) ; also on sheet 8
UART7_CTS_TELEM1: U28.R9(PE10) ; also on sheet 8
UART7_RTS_TELEM1: U28.L3(PF8) ; also on sheet 8
UART7_RX_TELEM1: U28.K2(PF6) ; also on sheet 8
UART7_TX_TELEM1: U28.P8(PE8) ; also on sheet 8
UART8_RX_GPS2: U28.A4(PE0) ; also on sheet 8
UART8_TX_GPS2: U28.A3(PE1) ; also on sheet 8
USART1_RX_GPS1: U28.B5(PB7) ; also on sheet 8
USART1_TX_GPS1: U28.B6(PB6) ; also on sheet 8
USART2_CTS_TELEM3: U28.D11(PD3) ; also on sheet 8
USART2_RTS_TELEM3: U28.D10(PD4) ; also on sheet 8
USART2_RX_TELEM3: U28.R2(PA3) ; also on sheet 8
USART2_TX_TELEM3: U28.C11(PD5) ; also on sheet 8
USART3_RX_DEBUG: D3.2(A) U28.P14(PD9)
USART3_TX_DEBUG: D2.1(I/O) D2.10(NC) H1.2 U28.P15(PD8) U30.2
USART6_RX_FROM_IO__RC_INPUT: U28.G15(PC7) ; also on sheet 10
USART6_TX_TO_IO__NC: U28.H15(PC6) ; also on sheet 10
USB_D_N: R48.2 U28.C15(PA11)
USB_D_P: R47.2 U28.B15(PA12)
VCAP: C43.1 C44.1
Net-(C35-2): C35.2 U13.10(VDD)
Net-(C42-2): C42.2 TF1.4(VDD) U16.A2(OUT)
Net-(C50-1): C50.1 R35.1 R36.2 U18.1(UV1)
Net-(C51-1): C51.1 R38.1 R39.2 U18.3(UV2)
Net-(C52-1): C52.1 R41.1 R42.2 U18.5(UV3)
Net-(C88-1): C88.1 U26.8(SS/TR)
Net-(C90-1): C90.1 U27.8(NR/SS)
Net-(C93-2): C93.2 U31.10(REGOUT)
Net-(C97-2): C97.2 U33.10(VDD)
Net-(C103-2): C103.2 U28.M10(VCAP)
Net-(C104-2): C104.2 U28.F13(VCAP)
Net-(C151-1): C151.1 U42.6(CSET2)
Net-(C161-1): C161.1 U43.6(CSET2)
Net-(C180-3): C180.3(OUT) C181.1 C182.1 U48.1(IN)
Net-(C186-3): C186.3(OUT) C187.1 C188.1 U49.1(IN)
Net-(C192-3): C192.3(OUT) C193.1 C194.1 U50.1(IN)
Net-(C198-3): C198.3(OUT) C199.1 C200.1 U51.1(IN)
Net-(CN11-2): CN11.2 R31.1 U15.7(CANH)
Net-(CN11-3): CN11.3 R31.2 U15.6(CANL)
Net-(CN13-2): CN13.2 R48.1 U29.4(D2(0))
Net-(CN13-3): CN13.3 R47.1 U29.6(D1(0))
Net-(CN14-2): CN14.2 R87.1 U32.7(CANH)
Net-(CN14-3): CN14.3 R87.2 U32.6(CANL)
Net-(D7-1): D7.1 R33.1 U17.4
Net-(D8-1): D8.1 R34.1 U17.3
Net-(D9-1): D9.1 R45.1 U19.4
Net-(D10-1): D10.1 R46.1 U19.3
Net-(D34-1): D34.1(K) R177.1
Net-(L1-1): L1.1 U26.2(SW)
Net-(LED1-2): LED1.2(A) R84.1
Net-(LED2-1): LED2.1(A) R85.1
Net-(LED3-2): LED3.2(A) R86.1
Net-(R6-1): R6.1 U5.7(HOLD#)
Net-(R7-1): R7.1 U5.3(WP#)
Net-(R21-2): R21.2 U9.A5(CC1) U9.B5(CC2)
Net-(R36-1): R36.1 R37.2 U18.2(OV1)
Net-(R39-1): R39.1 R40.2 U18.4(OV2)
Net-(R41-2): R41.2 U18.19(V3)
Net-(R42-1): R42.1 R43.2 U18.6(OV3)
Net-(R44-1): R44.1 U18.24(HYS)
Net-(R49-2): R49.2 U20.4(FAULT#)
Net-(R50-2): R50.2 U20.5(CE#)
Net-(R51-2): R51.2 U20.7(ILIM)
Net-(R54-2): R54.2 U23.4(FAULT#)
Net-(R55-2): R55.2 U23.5(CE#)
Net-(R56-2): R56.2 U23.7(ILIM)
Net-(R73-2): R73.2 U26.7(MODE/S-CONF)
Net-(R74-1): R74.1 R75.2 U26.9(FB/VSET)
Net-(R77-1): R77.1 R78.2 U27.3(FB)
Net-(U9-A6): U9.A6(DP1) U9.B6(DP2) U29.1(D1(i))
Net-(U9-A7): U9.A7(DN1) U9.B7(DN2) U29.3(D2(i))

Not connected (* = marked no-connect by the designer): TF1 9(CD)*; U9 A8(SBU1)* B8(SBU2)*; U18 11(CAS)* 22(EN)* 23(SHDN#)*; U20 3(NC)*; U23 3(NC)*; U28 H13(VDD33USB) N1(VREF-) P1(VREF+); U31 1(NC)* 2(NC)* 3(NC)* 4(NC)* 5(NC)* 6(NC)* 7(AUX_CL)* 14(NC)* 15(NC)* 16(NC)* 17(NC)* 19(INT2)* 21(AUX_DA)*; U33 7(INT)*; U34 2(RESV)* 3(RESV)* 7(RESV)* 10(RESV)* 11(RESV)*; U43 8(VOUT1)*; U48 4(N/C)*; U49 4(N/C)*; U50 4(N/C)*; U51 4(N/C)*

## Notes on the sheets
sheet 2
- SPEKTRUM Power
- 5V_IN to FMU_VDD_3V3
- VDD_BUCK_OUT= 3.6V
- Power Domain Sensors1
- FMU_VDD_3V3=3.2V~3.42V
- Max Dropout Voltage=400mV
  Typical Dropout voltage=180mV
- Power Domain Sensors2
- VDD_5V Peripheral Power Protection
- Power Domain Sensors3
- Power Domain Sensors4
- Ethernet Power
sheet 3
- 16MHz OSC
- HW REV and VER
  (Revision 1)
- FMU Status
- Connect to 16 MHz Crystal, use load capacitors and routing guidelines from data sheet.
  Recommend 15 ppm or better for both tolerance and stability.
- PWR
- BOOT0 Switch
- ACT
- RESET FUNCTION
- B/E
- Place capacitor
  close to MCU pad
- 32.768KHz OSC
- DEBUG CONNECTOR (FMU)
- CAN1
- 2.54 x 4 Pin for debug
- 2.54 x 6 Pin for debug
- CAN2
- SPI5_SCK
- SPI5_MOSI
- SPI5_MISO
- SPI5_NCS1
- 2.54 x 4 Pin for debug
- FRAM
- I2C Pullup Resistors
- SD Card (MMC2)
- MCU DECAPS
- VBAT
sheet 4
- Power 1
  (VDD_5V_BRICK1)
- FMU_VDD_3V3
- (3.3V)
- STM32H753IIK
  (MCU)
- LTC4417UF
  (Power Switch)
- VDD_5V_IN
- Power 2
  (VDD_5V_BRICK2)
- TPS62903
  (BUCK)
- TPS7A92
  (LDO)
- (5V)
- (3.6V)
- FM25V02A-G
  (FRAM)
- USB
  (VBUS)
- SDCARD
- Debug Connector
- VDD_5V_HIPOWER
- BQ24315DSGR
- GPS1
- (5V)
- GPS2
- VDD_5V_PERIPH
- TELEM1
- BQ24315DSGR
- (5V)
- TELEM2
- TELEM3
- Serial
  (UART4)
- SPI
  (SPI6)
- VDD_3V3_SPEKTRUM
- MIC5332
  (LDO)
- (3.3V)
- IO_VDD_3V3
- (3.3V)
- VDD_3V3_SENSORS
- ICM20602
  (IMU1)
- LP5907QMFX-3.3Q1
  (LDO)
- (3.3V)
- ICM42605
  (IMU2)
- BMI088
  (IMU3)
- BMP388
  (BARO)
- BMM150
  (MAG)
sheet 5
- IMU3 & SPI1
  (ICM20649)
- SPI1_MOSI
- SPI1_MISO
- SPI1_SCK
- SPI1_NCS1
- SPIX_SYNC
- SPI1_DRDY1
- BARO2 & I2C2
  (BMP388)
- I2C2_SDA
- I2C2_SCL
- I2C2_DRDY1
- Pin: SDO
  I2C Address Select
  VSS = 0x76
  VDDIO = 0x77
sheet 6
- IMU1 & SPI3
  (BMI088)
- IMU2 & SPI2
  (ICM-42688-P)
- BARO1 & I2C4
  (BMP388)
- EEPROM & I2C4
  (24AA64)
- I2C2_SDA
- I2C2_SCL
- Pin: SDO
  I2C Address Select
  VSS = 0x76
  VDDIO = 0x77
- MAG1 & I2C4
  (BMM150)
